# Altium project audio_dev_pcb.PrjPcb (part 1 of 3)
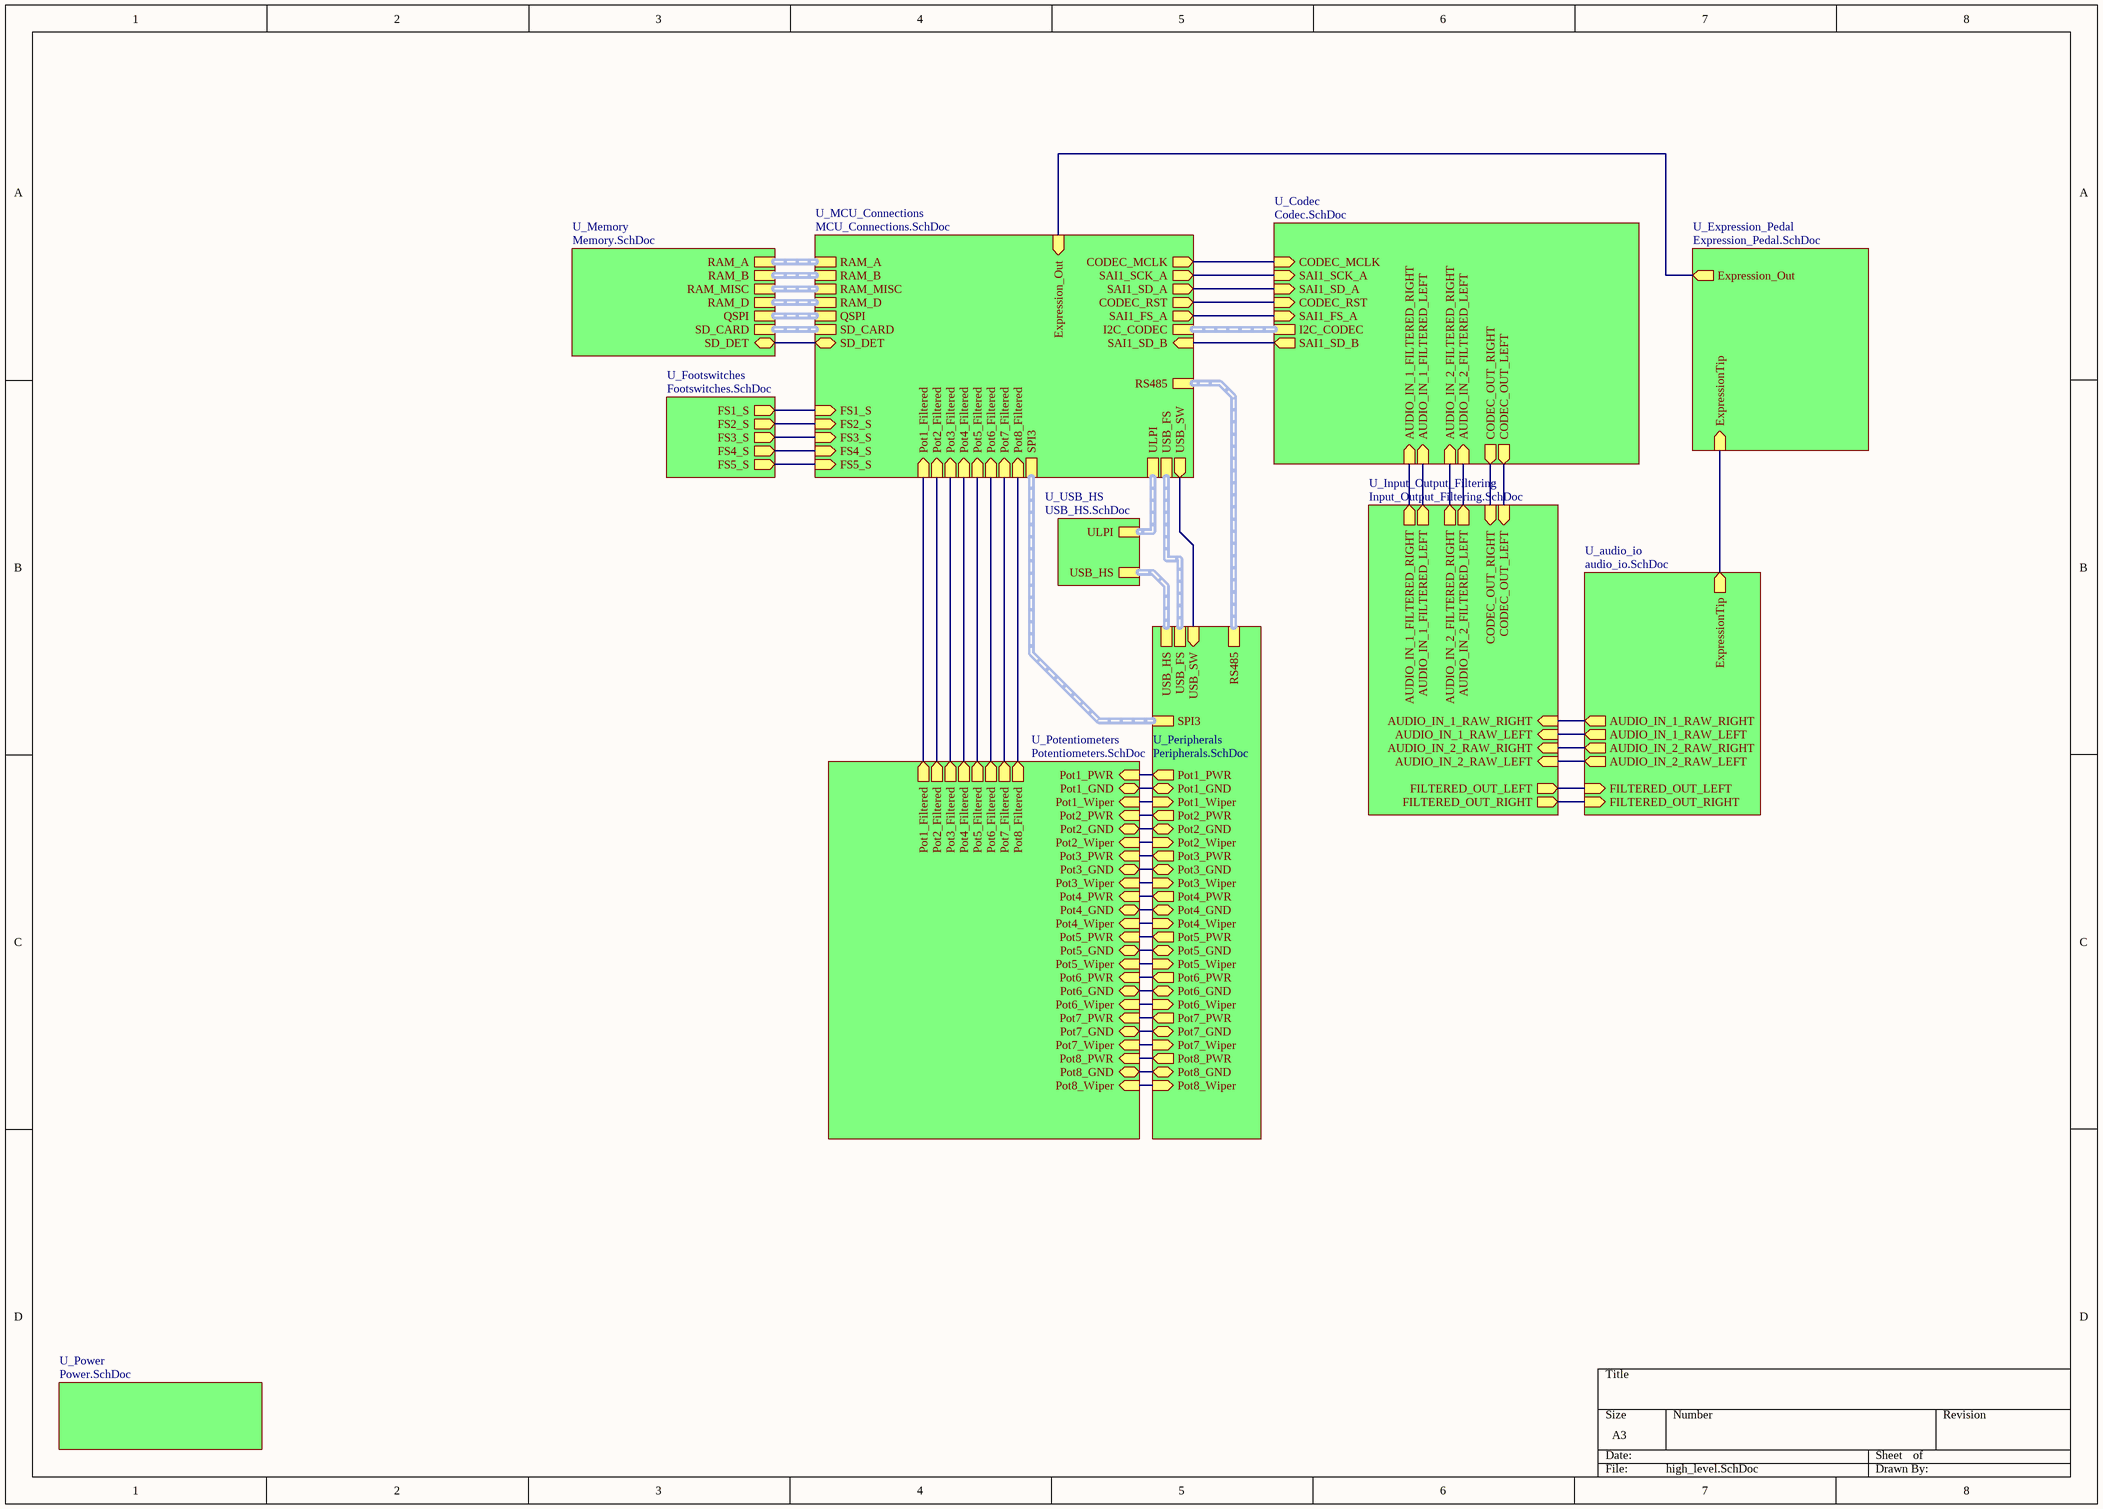
[diagram p0: high_level.SchDoc]
13 sheets, 355 parts. Net scope: hierarchical (ports join the sheet entries above them; power ports are global).
Board file: PCB1.PcbDoc
Sheets:
  high_level.SchDoc
    U_Codec = Codec.SchDoc
    U_Expression_Pedal = Expression_Pedal.SchDoc
    U_Input_Output_Filtering = Input_Output_Filtering.SchDoc
    U_Memory = Memory.SchDoc
    U_Power = Power.SchDoc
    U_USB_HS = USB_HS.SchDoc
    U_Peripherals = Peripherals.SchDoc
    U_Potentiometers = Potentiometers.SchDoc
    U_MCU_Connections = MCU_Connections.SchDoc
      U_MCU = MCU.SchDoc
    U_audio_io = audio_io.SchDoc
    U_Footswitches = Footswitches.SchDoc

## Sheet high_level.SchDoc
size A3; SheetNumber: 1; SheetTotal: 13

### Sub-sheets
U_audio_io = audio_io.SchDoc: ExpressionTip (out), AUDIO_IN_1_RAW_RIGHT (out), AUDIO_IN_1_RAW_LEFT (out), AUDIO_IN_2_RAW_LEFT (out), FILTERED_OUT_LEFT (in), FILTERED_OUT_RIGHT (in), AUDIO_IN_2_RAW_RIGHT (out)
U_Codec = Codec.SchDoc: CODEC_MCLK (in), SAI1_SCK_A (in), SAI1_SD_B (out), SAI1_SD_A (in), CODEC_RST (in), AUDIO_IN_2_FILTERED_LEFT (in), AUDIO_IN_2_FILTERED_RIGHT (in), CODEC_OUT_RIGHT (out), CODEC_OUT_LEFT (out), AUDIO_IN_1_FILTERED_LEFT (in), AUDIO_IN_1_FILTERED_RIGHT (in), I2C_CODEC (harness I2C), SAI1_FS_A (in)
U_Expression_Pedal = Expression_Pedal.SchDoc: ExpressionTip (in), Expression_Out (out)
U_Footswitches = Footswitches.SchDoc: FS1_S (out), FS2_S (out), FS3_S (out), FS4_S (out), FS5_S (out)
U_Input_Output_Filtering = Input_Output_Filtering.SchDoc: AUDIO_IN_1_RAW_LEFT (in), AUDIO_IN_1_FILTERED_LEFT (out), AUDIO_IN_1_RAW_RIGHT (in), AUDIO_IN_1_FILTERED_RIGHT (out), CODEC_OUT_LEFT (in), FILTERED_OUT_LEFT (out), CODEC_OUT_RIGHT (in), FILTERED_OUT_RIGHT (out), AUDIO_IN_2_RAW_LEFT (in), AUDIO_IN_2_FILTERED_LEFT (out), AUDIO_IN_2_RAW_RIGHT (in), AUDIO_IN_2_FILTERED_RIGHT (out)
U_MCU_Connections = MCU_Connections.SchDoc: ULPI (harness ULPI), RAM_A (harness RAM_A), RAM_B (harness RAM_B), RAM_MISC (harness RAM_MISC), RAM_D (harness RAM_D), QSPI (harness QSPI), SD_CARD (harness SD_CARD), USB_FS (harness USB_FS), USB_SW (out), I2C_CODEC (harness I2C), CODEC_MCLK (out), SAI1_SCK_A (out), SAI1_SD_B (in), SAI1_SD_A (out), CODEC_RST (out), Expression_Out (in), SAI1_FS_A (out), SD_DET (bidir), SPI3 (harness SPI3), Pot1_Filtered (in), Pot2_Filtered (in), Pot3_Filtered (in), Pot4_Filtered (in), Pot5_Filtered (in), Pot6_Filtered (in), Pot7_Filtered (in), Pot8_Filtered (in), RS485 (harness RS485), FS1_S (in), FS2_S (in), FS3_S (in), FS4_S (in), FS5_S (in)
U_Memory = Memory.SchDoc: RAM_D (harness RAM_D), RAM_A (harness RAM_A), RAM_B (harness RAM_B), RAM_MISC (harness RAM_MISC), SD_CARD (harness SD_CARD), SD_DET (bidir), QSPI (harness QSPI)
U_Peripherals = Peripherals.SchDoc: USB_SW (in), USB_HS (harness USB_HS), USB_FS (harness USB_FS), SPI3 (harness SPI3), Pot5_PWR (out), Pot5_Wiper (in), Pot5_GND (bidir), Pot4_PWR (out), Pot4_Wiper (in), Pot4_GND (bidir), Pot8_PWR (out), Pot8_Wiper (in), Pot8_GND (bidir), Pot6_PWR (out), Pot6_Wiper (in), Pot6_GND (bidir), Pot2_PWR (out), Pot2_Wiper (in), Pot2_GND (bidir), Pot1_Wiper (in), Pot1_GND (bidir), Pot7_PWR (out), Pot7_Wiper (in), Pot7_GND (bidir), Pot3_PWR (out), Pot3_Wiper (in), Pot3_GND (bidir), Pot1_PWR (out), RS485 (harness RS485)
U_Potentiometers = Potentiometers.SchDoc: Pot1_PWR (in), Pot1_Wiper (in), Pot1_GND (bidir), Pot2_PWR (in), Pot2_Wiper (in), Pot2_GND (bidir), Pot3_PWR (in), Pot3_Wiper (in), Pot3_GND (bidir), Pot4_PWR (in), Pot4_Wiper (in), Pot4_GND (bidir), Pot5_PWR (in), Pot5_Wiper (in), Pot5_GND (bidir), Pot6_PWR (in), Pot6_Wiper (in), Pot6_GND (bidir), Pot7_PWR (in), Pot7_Wiper (in), Pot7_GND (bidir), Pot8_PWR (in), Pot8_Wiper (in), Pot8_GND (bidir), Pot1_Filtered (out), Pot2_Filtered (out), Pot3_Filtered (out), Pot7_Filtered (out), Pot4_Filtered (out), Pot5_Filtered (out), Pot6_Filtered (out), Pot8_Filtered (out)
U_Power = Power.SchDoc: no entries
U_USB_HS = USB_HS.SchDoc: USB_HS (harness USB), ULPI (harness ULPI)

### Nets
+3V3: sheet U_Peripherals/Pot5_PWR, sheet U_Peripherals/Pot4_PWR, sheet U_Peripherals/Pot8_PWR, sheet U_Peripherals/Pot6_PWR, sheet U_Peripherals/Pot2_PWR, sheet U_Peripherals/Pot7_PWR, sheet U_Peripherals/Pot3_PWR, sheet U_Peripherals/Pot1_PWR, sheet U_Potentiometers/Pot1_PWR, sheet U_Potentiometers/Pot2_PWR, sheet U_Potentiometers/Pot3_PWR, sheet U_Potentiometers/Pot4_PWR, sheet U_Potentiometers/Pot5_PWR, sheet U_Potentiometers/Pot6_PWR, sheet U_Potentiometers/Pot7_PWR, sheet U_Potentiometers/Pot8_PWR
GND: sheet U_Peripherals/Pot5_GND, sheet U_Peripherals/Pot4_GND, sheet U_Peripherals/Pot8_GND, sheet U_Peripherals/Pot6_GND, sheet U_Peripherals/Pot2_GND, sheet U_Peripherals/Pot1_GND, sheet U_Peripherals/Pot7_GND, sheet U_Peripherals/Pot3_GND, sheet U_Potentiometers/Pot1_GND, sheet U_Potentiometers/Pot2_GND, sheet U_Potentiometers/Pot3_GND, sheet U_Potentiometers/Pot4_GND, sheet U_Potentiometers/Pot5_GND, sheet U_Potentiometers/Pot6_GND, sheet U_Potentiometers/Pot7_GND, sheet U_Potentiometers/Pot8_GND
AUDIO_IN_1_FILTERED_LEFT: sheet U_Codec/AUDIO_IN_1_FILTERED_LEFT, sheet U_Input_Output_Filtering/AUDIO_IN_1_FILTERED_LEFT
AUDIO_IN_1_FILTERED_RIGHT: sheet U_Codec/AUDIO_IN_1_FILTERED_RIGHT, sheet U_Input_Output_Filtering/AUDIO_IN_1_FILTERED_RIGHT
AUDIO_IN_1_RAW_LEFT: sheet U_Input_Output_Filtering/AUDIO_IN_1_RAW_LEFT, sheet U_audio_io/AUDIO_IN_1_RAW_LEFT
AUDIO_IN_1_RAW_RIGHT: sheet U_Input_Output_Filtering/AUDIO_IN_1_RAW_RIGHT, sheet U_audio_io/AUDIO_IN_1_RAW_RIGHT
AUDIO_IN_2_FILTERED_LEFT: sheet U_Codec/AUDIO_IN_2_FILTERED_LEFT, sheet U_Input_Output_Filtering/AUDIO_IN_2_FILTERED_LEFT
AUDIO_IN_2_FILTERED_RIGHT: sheet U_Codec/AUDIO_IN_2_FILTERED_RIGHT, sheet U_Input_Output_Filtering/AUDIO_IN_2_FILTERED_RIGHT
AUDIO_IN_2_RAW_LEFT: sheet U_Input_Output_Filtering/AUDIO_IN_2_RAW_LEFT, sheet U_audio_io/AUDIO_IN_2_RAW_LEFT
AUDIO_IN_2_RAW_RIGHT: sheet U_Input_Output_Filtering/AUDIO_IN_2_RAW_RIGHT, sheet U_audio_io/AUDIO_IN_2_RAW_RIGHT
CODEC_MCLK: sheet U_Codec/CODEC_MCLK, sheet U_MCU_Connections/CODEC_MCLK
CODEC_OUT_LEFT: sheet U_Codec/CODEC_OUT_LEFT, sheet U_Input_Output_Filtering/CODEC_OUT_LEFT
CODEC_OUT_RIGHT: sheet U_Codec/CODEC_OUT_RIGHT, sheet U_Input_Output_Filtering/CODEC_OUT_RIGHT
CODEC_RST: sheet U_Codec/CODEC_RST, sheet U_MCU_Connections/CODEC_RST
Expression_Out: sheet U_Expression_Pedal/Expression_Out, sheet U_MCU_Connections/Expression_Out
ExpressionTip: sheet U_Expression_Pedal/ExpressionTip, sheet U_audio_io/ExpressionTip
FILTERED_OUT_LEFT: sheet U_Input_Output_Filtering/FILTERED_OUT_LEFT, sheet U_audio_io/FILTERED_OUT_LEFT
FILTERED_OUT_RIGHT: sheet U_Input_Output_Filtering/FILTERED_OUT_RIGHT, sheet U_audio_io/FILTERED_OUT_RIGHT
FS_SIG1: sheet U_MCU_Connections/FS1_S, sheet U_Footswitches/FS1_S
FS_SIG2: sheet U_MCU_Connections/FS2_S, sheet U_Footswitches/FS2_S
FS_SIG3: sheet U_MCU_Connections/FS3_S, sheet U_Footswitches/FS3_S
FS_SIG4: sheet U_MCU_Connections/FS4_S, sheet U_Footswitches/FS4_S
FS_SIG5: sheet U_MCU_Connections/FS5_S, sheet U_Footswitches/FS5_S
Pot1_Filtered: sheet U_Potentiometers/Pot1_Filtered, sheet U_MCU_Connections/Pot1_Filtered
Pot1_Wiper: sheet U_Peripherals/Pot1_Wiper, sheet U_Potentiometers/Pot1_Wiper
Pot2_Filtered: sheet U_Potentiometers/Pot2_Filtered, sheet U_MCU_Connections/Pot2_Filtered
Pot2_Wiper: sheet U_Peripherals/Pot2_Wiper, sheet U_Potentiometers/Pot2_Wiper
Pot3_Filtered: sheet U_Potentiometers/Pot3_Filtered, sheet U_MCU_Connections/Pot3_Filtered
Pot3_Wiper: sheet U_Peripherals/Pot3_Wiper, sheet U_Potentiometers/Pot3_Wiper
Pot4_Filtered: sheet U_Potentiometers/Pot4_Filtered, sheet U_MCU_Connections/Pot4_Filtered
Pot4_Wiper: sheet U_Peripherals/Pot4_Wiper, sheet U_Potentiometers/Pot4_Wiper
Pot5_Filtered: sheet U_Potentiometers/Pot5_Filtered, sheet U_MCU_Connections/Pot5_Filtered
Pot5_Wiper: sheet U_Peripherals/Pot5_Wiper, sheet U_Potentiometers/Pot5_Wiper
Pot6_Filtered: sheet U_Potentiometers/Pot6_Filtered, sheet U_MCU_Connections/Pot6_Filtered
Pot6_Wiper: sheet U_Peripherals/Pot6_Wiper, sheet U_Potentiometers/Pot6_Wiper
Pot7_Filtered: sheet U_Potentiometers/Pot7_Filtered, sheet U_MCU_Connections/Pot7_Filtered
Pot7_Wiper: sheet U_Peripherals/Pot7_Wiper, sheet U_Potentiometers/Pot7_Wiper
Pot8_Filtered: sheet U_Potentiometers/Pot8_Filtered, sheet U_MCU_Connections/Pot8_Filtered
Pot8_Wiper: sheet U_Peripherals/Pot8_Wiper, sheet U_Potentiometers/Pot8_Wiper
SAI1_FS_A: sheet U_Codec/SAI1_FS_A, sheet U_MCU_Connections/SAI1_FS_A
SAI1_SCK_A: sheet U_Codec/SAI1_SCK_A, sheet U_MCU_Connections/SAI1_SCK_A
SAI1_SD_A: sheet U_Codec/SAI1_SD_A, sheet U_MCU_Connections/SAI1_SD_A
SAI1_SD_B: sheet U_Codec/SAI1_SD_B, sheet U_MCU_Connections/SAI1_SD_B
SD_DET: sheet U_Memory/SD_DET, sheet U_MCU_Connections/SD_DET
USB_SW: sheet U_Peripherals/USB_SW, sheet U_MCU_Connections/USB_SW

### Buses and harness runs
harness sheet U_Codec/I2C_CODEC = sheet U_MCU_Connections/I2C_CODEC
harness sheet U_MCU_Connections/QSPI = sheet U_Memory/QSPI
harness sheet U_MCU_Connections/RAM_A = sheet U_Memory/RAM_A
harness sheet U_MCU_Connections/RAM_B = sheet U_Memory/RAM_B
harness sheet U_MCU_Connections/RAM_D = sheet U_Memory/RAM_D
harness sheet U_MCU_Connections/RAM_MISC = sheet U_Memory/RAM_MISC
harness sheet U_MCU_Connections/RS485 = sheet U_Peripherals/RS485
harness sheet U_MCU_Connections/SD_CARD = sheet U_Memory/SD_CARD
harness sheet U_MCU_Connections/SPI3 = sheet U_Peripherals/SPI3
harness sheet U_MCU_Connections/ULPI = sheet U_USB_HS/ULPI
harness sheet U_MCU_Connections/USB_FS = sheet U_Peripherals/USB_FS
harness sheet U_Peripherals/USB_HS = sheet U_USB_HS/USB_HS

## Sheet Codec.SchDoc
size A3; SheetNumber: 8; SheetTotal: 13
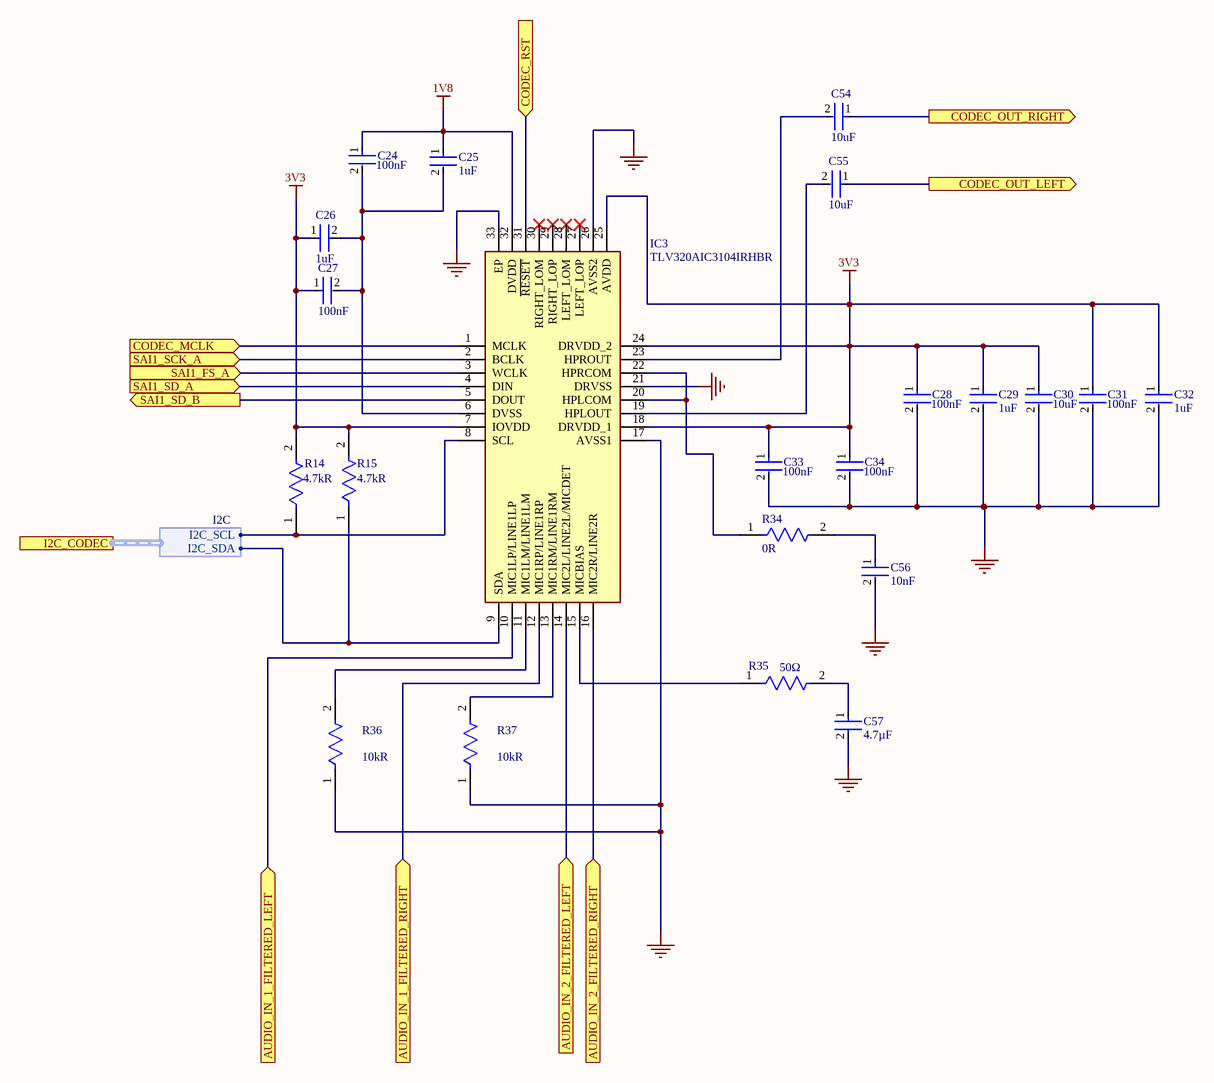
[diagram p1: Codec.SchDoc]

### Parts
C24  Capacitance: 100nF  [FP-GRM033-0_03-IPC_C]  (hidden comment: GRM033C71C104ME14J)
C25  Capacitance: 1uF  [FP-GRM155-0_1-IPC_B]  (hidden comment: GRM155C70J105ME11J)
C26  Capacitance: 1uF  [FP-GRM155-0_1-IPC_B]  (hidden comment: GRM155C70J105ME11J)
C27  Capacitance: 100nF  [FP-GRM033-0_03-IPC_C]  (hidden comment: GRM033C71C104ME14J)
C28  Capacitance: 100nF  [FP-GRM033-0_03-IPC_C]  (hidden comment: GRM033C71C104ME14J)
C29  Capacitance: 1uF  [FP-GRM155-0_1-IPC_B]  (hidden comment: GRM155C70J105ME11J)
C30  Capacitance: 10uF  [FP-GRM21B-0_15-IPC_C]  (hidden comment: GRM21BC81E106KE51K)
C31  Capacitance: 100nF  [FP-GRM033-0_03-IPC_C]  (hidden comment: GRM033C71C104ME14J)
C32  Capacitance: 1uF  [FP-GRM155-0_1-IPC_B]  (hidden comment: GRM155C70J105ME11J)
C33  Capacitance: 100nF  [FP-GRM033-0_03-IPC_C]  (hidden comment: GRM033C71C104ME14J)
C34  Capacitance: 100nF  [FP-GRM033-0_03-IPC_C]  (hidden comment: GRM033C71C104ME14J)
C54  Capacitance: 10uF  [FP-GRM21B-0_15-IPC_C]  (hidden comment: GRM21BC81E106KE51K)
C55  Capacitance: 10uF  [FP-GRM21B-0_15-IPC_C]  (hidden comment: GRM21BC81E106KE51K)
C56  Capacitance: 10nF  [FP-GCM155-0_05-MFG]  (hidden comment: GCM155R71H103KA55W)
C57  Capacitance: 4.7µF  [FP-GCM155-0_2-MFG]  (hidden comment: GCM155D70G475ME36D)
IC3  TLV320AIC3104IRHBR  [TLV320AIC3104IRHBR]
R14  Resistance: 4.7kR  [FP-RC1005-IPC_C]  (hidden comment: RC1005J472CS)
R15  Resistance: 4.7kR  [FP-RC1005-IPC_C]  (hidden comment: RC1005J472CS)
R34  Resistance: 0R  [FP-RMCF0402-MFG]  (hidden comment: RMCF0402ZT0R00)
R35  Resistance: 50Ω  [FP-RC0402-0_4-MFG]  (hidden comment: RC0402JR-0750RL)
R36  Resistance: 10kR  [FP-RC0402-0_4-IPC_A]  (hidden comment: RC0402FR-1310KL)
R37  Resistance: 10kR  [FP-RC0402-0_4-IPC_A]  (hidden comment: RC0402FR-1310KL)

### Ports
AUDIO_IN_1_FILTERED_LEFT (in, see high_level[6B], Input_Output_Filtering[6B]), AUDIO_IN_1_FILTERED_RIGHT (in, see high_level[6B], Input_Output_Filtering[6C]), AUDIO_IN_2_FILTERED_LEFT (in, see high_level[6B], Input_Output_Filtering[6A]), AUDIO_IN_2_FILTERED_RIGHT (in, see high_level[6B], Input_Output_Filtering[6B]), CODEC_MCLK (in, see high_level[5A], MCU_Connections[5B]), CODEC_OUT_LEFT (out, see high_level[6B], Input_Output_Filtering[3C]), CODEC_OUT_RIGHT (out, see high_level[6B], Input_Output_Filtering[3D]), CODEC_RST (in, see high_level[5A], MCU_Connections[5B]), I2C_CODEC (harness I2C, see high_level[5A], MCU_Connections[5B]), SAI1_FS_A (in, see high_level[5A], MCU_Connections[5B]), SAI1_SCK_A (in, see high_level[5A], MCU_Connections[5B]), SAI1_SD_A (in, see high_level[5A], MCU_Connections[5B]), SAI1_SD_B (out, see high_level[5A], MCU_Connections[5B])

### Harnesses
I2C: I2C_SCL, I2C_SDA

### Nets
1V8: C24.1 C25.1 IC3.32(DVDD)
3V3: C26.1 C27.1 C28.1 C29.1 C30.1 C31.1 C32.1 C33.1 C34.1 IC3.7(IOVDD) IC3.18(DRVDD_1) IC3.24(DRVDD_2) IC3.25(AVDD) R14.2 R15.2
GND: C28.2 C29.2 C30.2 C31.2 C32.2 C33.2 C34.2 C56.2 C57.2 IC3.17(AVSS1) IC3.21(DRVSS) IC3.26(AVSS2) IC3.33(EP) R36.1 R37.1
AUDIO_IN_1_FILTERED_LEFT: IC3.10(MIC1LP/LINE1LP) ; port AUDIO_IN_1_FILTERED_LEFT
AUDIO_IN_1_FILTERED_RIGHT: IC3.12(MIC1RP/LINE1RP) ; port AUDIO_IN_1_FILTERED_RIGHT
AUDIO_IN_2_FILTERED_LEFT: IC3.14(MIC2L/LINE2L/MICDET) ; port AUDIO_IN_2_FILTERED_LEFT
AUDIO_IN_2_FILTERED_RIGHT: IC3.16(MIC2R/LINE2R) ; port AUDIO_IN_2_FILTERED_RIGHT
CODEC_MCLK: IC3.1(MCLK) ; port CODEC_MCLK
CODEC_OUT_LEFT: C55.1 ; port CODEC_OUT_LEFT
CODEC_OUT_RIGHT: C54.1 ; port CODEC_OUT_RIGHT
CODEC_RST: IC3.31(~{RESET}) ; port CODEC_RST
SAI1_FS_A: IC3.3(WCLK) ; port SAI1_FS_A
SAI1_SCK_A: IC3.2(BCLK) ; port SAI1_SCK_A
SAI1_SD_A: IC3.4(DIN) ; port SAI1_SD_A
SAI1_SD_B: IC3.5(DOUT) ; port SAI1_SD_B
NetC24_2: C24.2 C25.2 C26.2 C27.2 IC3.6(DVSS)
NetC54_2: C54.2 IC3.23(HPROUT)
NetC55_2: C55.2 IC3.19(HPLOUT)
NetC56_1: C56.1 R34.2
NetC57_1: C57.1 R35.2
NetIC3_8: IC3.8(SCL) R14.1 ; port I2C_CODEC.I2C_SCL
NetIC3_9: IC3.9(SDA) R15.1 ; port I2C_CODEC.I2C_SDA
NetIC3_11: IC3.11(MIC1LM/LINE1LM) R36.2
NetIC3_13: IC3.13(MIC1RM/LINE1RM) R37.2
NetIC3_15: IC3.15(MICBIAS) R35.1
NetIC3_20: IC3.20(HPLCOM) IC3.22(HPRCOM) R34.1

Not connected (* = marked no-connect by the designer): IC3 27(LEFT_LOP)* 28(LEFT_LOM)* 29(RIGHT_LOP)* 30(RIGHT_LOM)*

### Library data of the parts
C24 C27 C28 C31 C33 C34 = CMP-06035-001619-1: Chip Multilayer Ceramic Capacitors for General Purpose, 0201, 0.10uF, X7S, 22%, 20%, 16V; Dielectric: X7S; Tolerance: 20%; Length: 600um; Width: 300um; Voltage Rating (DC): 16V; Thickness: 300um
C25 C26 C29 C32 = CMP-06035-036014-1: Chip Multilayer Ceramic Capacitors for General Purpose, 0402, 1.0uF, X7S, 22%, 20%, 6.3V; Tolerance: 20%; Dielectric: X7S; Length: 1mm; Voltage Rating (DC): 6.3V; Thickness: 500um; Width: 500um
C30 C54 C55 = CMP-06035-031044-1: Chip Multilayer Ceramic Capacitors for General Purpose, 0805, 10uF, X6S, 22%, 10%, 25V; Case/Package: 0805; Length: 2mm; Dielectric: X6S; Voltage Rating (DC): 25V; Thickness: 1.25mm; Width: 1.25mm; Tolerance: 10%
C56 = CMP-06035-055122-1: Ceramic Capacitor for Automotive 10nF ±10% 50VDC X7R 0402 Paper T/R
C57 = CMP-00260-135863758-1: GCM155D70G475ME36D AC 2C 216S Skt Recp; Tolerance: 20%; Voltage Rating: 4V; Material: Ceramic; Lifecycle Status: Production; Height: 700µm; Min Operating Temperature: -55°C; NexarPartId: 135863758; Max Operating Temperature: 125°C; Case/Package: 0402
IC3 = TLV320AIC3104IRHBR: Integrated Circuit; Manufacturer_Name: Texas Instruments; Datasheet Link: http://www.ti.com/lit/ds/symlink/tlv320aic3104.pdf; Height: 1mm; Manufacturer_Part_Number: TLV320AIC3104IRHBR; Mouser Part Number: 595-TLV320C3104IRHBR; Mouser Price/Stock: https://www.mouser.co.uk/ProductDetail/Texas-Instruments/TLV320AIC3104IRHBR?qs=t6sYTo5dwUzbYVbTYmm%2FAg%3D%3D; Arrow Part Number: TLV320AIC3104IRHBR; Arrow Price/Stock: https://www.arrow.com/en/products/tlv320aic3104irhbr/texas-instruments?utm_currency=USD&region=nac
R14 R15 = CMP-13261-005440-1: Res Thick Film 0402 4.7kΩ 5% 0.063W ±100ppm/°C Molded SMD T/R; Power Rating: 63mW; Voltage Rating (DC): 50V; Depth: 0.5mm; Length: 1mm; Package Quantity: 1; Composition: Thick Film; Temperature Coefficient: 100ppm/°C; Case Code (Metric): 1005; Mount: Surface Mount; Lead Free: Lead Free; Features: Moisture Resistant; Max Power Dissipation: 63mW; Tolerance: 5%; Height: 0.016inch; Case Code (Imperial): 0402; Packaging: Tape and Reel; Min Operating Temperature: -55°C; Radiation Hardening: No; Contact Plating: Tin; Case/Package: 0402; Width: 0.02inch; Military Standard: Not; Max Operating Temperature: 125°C; Number of Terminations: 2
R34 = CMP-26527-007617-1: RES 0 OHM JUMPER 1/16W 0402; Power Rating: 63mW; Working Voltage: 50V; Current Rating: 1A; Series: RMCF; RoHS Compliant: Yes; Features: Automotive AEC-Q200; Width: 0.02inch; Depth: 0.5mm; Resistor Type: Thick Film; Number of Terminations: 2; Radiation Hardening: No; Length: 0.039inch; Contact Plating: Tin; Case/Package: 0402; Min Operating Temperature: -55°C; Case Code (Metric): 1005; Construction: Rectangular; Mount: Surface Mount; Max Operating Temperature: 155°C; Max Power Dissipation: 63mW; Height: 0.016inch; Lead Free: Lead Free; Packaging: Tape and Reel; Technology: THICK FILM; Case Code (Imperial): 0402; Military Standard: Not
R35 = CMP-00621-24490980-1: RC0402JR-0750RL SMD Chip Resistor, 50 Ohm, ± 5%, 63 mW, 0402 [1005 Metric], Thick Film, General Purpose; Temperature Coefficient: 100ppm/°C; Max Power Dissipation: 63mW; Width: 508µm; RoHS: Compliant; Height: 406.4µm; Length: 990.6µm; Features: Moisture Resistant; Tolerance: 5%; Lead Free: Lead Free; Case/Package: 0402; NexarPartId: 24490980; Min Operating Temperature: -55°C; Composition: Thick Film; Packaging: Tape & Reel (TR); Schedule B: 8533210045, 8533210045; Number of Terminations: 2; Max Operating Temperature: 155°C
R36 R37 = CMP-2002-07854-2: RESISTOR 0402 10K 1%; Power Rating: 62.5mW; Voltage Rating (DC): 50V; Temperature Coefficient: 100ppm/°C; REACH SVHC: No SVHC; Case/Package: 0402; Termination: SMD/SMT; Max Operating Temperature: 155°C; Contact Plating: Tin; Resistance Tolerance: 1%; Radiation Hardening: No; Voltage Rating: 50V; Lead Free: Lead Free; Length: 1mm; Depth: 0.5mm; Number of Pins: 2; RoHS Compliant: Yes; Case Code (Imperial): 0402; Case Code (Metric): 1005; Min Operating Temperature: -55°C; Packaging: Tape and Reel; Technology: THICK FILM; Series: RC; Number of Terminations: 2; Resistor Type: Thick Film; Tolerance: 1%; Working Voltage: 50V; Military Standard: Not; Construction: Rectangular

## Sheet Expression_Pedal.SchDoc
size A3; SheetNumber: 9; SheetTotal: 13
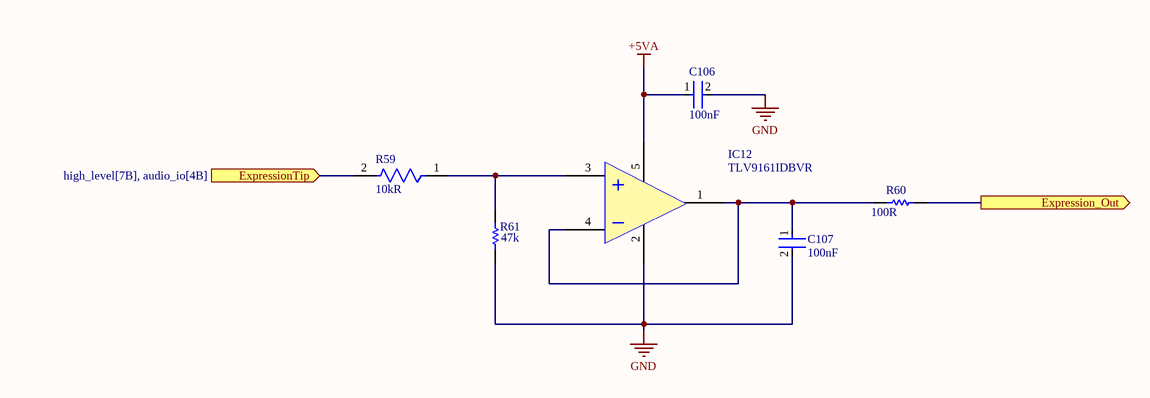
[diagram p2: Expression_Pedal.SchDoc]

### Parts
C106  Capacitance: 100nF  [FP-GRM033-0_03-IPC_C]  (hidden comment: GRM033C71C104ME14J)
C107  Capacitance: 100nF  [FP-GRM033-0_03-IPC_C]  (hidden comment: GRM033C71C104ME14J)
IC12  TLV9161IDBVR  [SOT95P280X145-5N]
R59  Resistance: 10kR  [FP-RC0402-0_4-IPC_A]  (hidden comment: RC0402FR-1310KL)
R60  Resistance: 100R  [RESC1005X40X25NL05T10]  (hidden comment: RC0402JR-07100RL)
R61  Resistance: 47k  [RESC1005X40X25LL05T10]  (hidden comment: RC0402JR-0747KL)

### Ports
Expression_Out (out, see high_level[7A], MCU_Connections[7B]), ExpressionTip (in, see high_level[7B], audio_io[4B])

### Nets
+5VA: C106.1 IC12.5(V+)
GND: C106.2 C107.2 IC12.2(V-) R61.1
Expression_Out: R60.2 ; port Expression_Out
ExpressionTip: R59.2 ; port ExpressionTip
NetC107_1: C107.1 IC12.1(OUT) IC12.4(IN-) R60.1
NetIC12_3: IC12.3(IN+) R59.1 R61.2

### Library data of the parts
C106 C107 = CMP-06035-001619-1: as C24 on sheet Codec; Dielectric: X7S; Tolerance: 20%; Length: 600um; Width: 300um; Voltage Rating (DC): 16V; Thickness: 300um
IC12 = TLV9161IDBVR: Integrated Circuit; Manufacturer_Name: Texas Instruments; Datasheet Link: https://www.ti.com/lit/ds/symlink/tlv9161.pdf?HQS=dis-mous-null-mousermode-dsf-pf-null-wwe&ts=1675947383550&ref_url=https%253A%252F%252Fwww.mouser.de%252F; Height: 1.45mm; Manufacturer_Part_Number: TLV9161IDBVR; Mouser Part Number: 595-TLV9161IDBVR; Mouser Price/Stock: https://www.mouser.co.uk/ProductDetail/Texas-Instruments/TLV9161IDBVR?qs=Rp5uXu7WBW%2FkWJAGvxG3xQ%3D%3D; Arrow Part Number: TLV9161IDBVR; Arrow Price/Stock: https://www.arrow.com/en/products/tlv9161idbvr/texas-instruments?utm_currency=USD&region=nac
R59 = CMP-2002-07854-2: as R36 on sheet Codec; REACH SVHC: No SVHC; Case/Package: 0402; Termination: SMD/SMT; Max Operating Temperature: 155°C; Contact Plating: Tin; Resistance Tolerance: 1%; Radiation Hardening: No; Voltage Rating: 50V; Lead Free: Lead Free; Length: 1mm; Depth: 0.5mm; Number of Pins: 2; RoHS Compliant: Yes; Case Code (Imperial): 0402; Case Code (Metric): 1005; Min Operating Temperature: -55°C; Packaging: Tape and Reel; Technology: THICK FILM; Series: RC; Number of Terminations: 2; Resistor Type: Thick Film; Tolerance: 1%; Working Voltage: 50V; Military Standard: Not; Construction: Rectangular
R60 = CMP-2002-07914-1: Manufacturer: Yageo / Phycomp; Part Number: RC0402JR-07100RL
R61 = CMP-1011-00114-2: Manufacturer: Yageo / Phycomp; Part Number: RC0402JR-0747KL

## Sheet Input_Output_Filtering.SchDoc
size A2; SheetNumber: 11; SheetTotal: 13
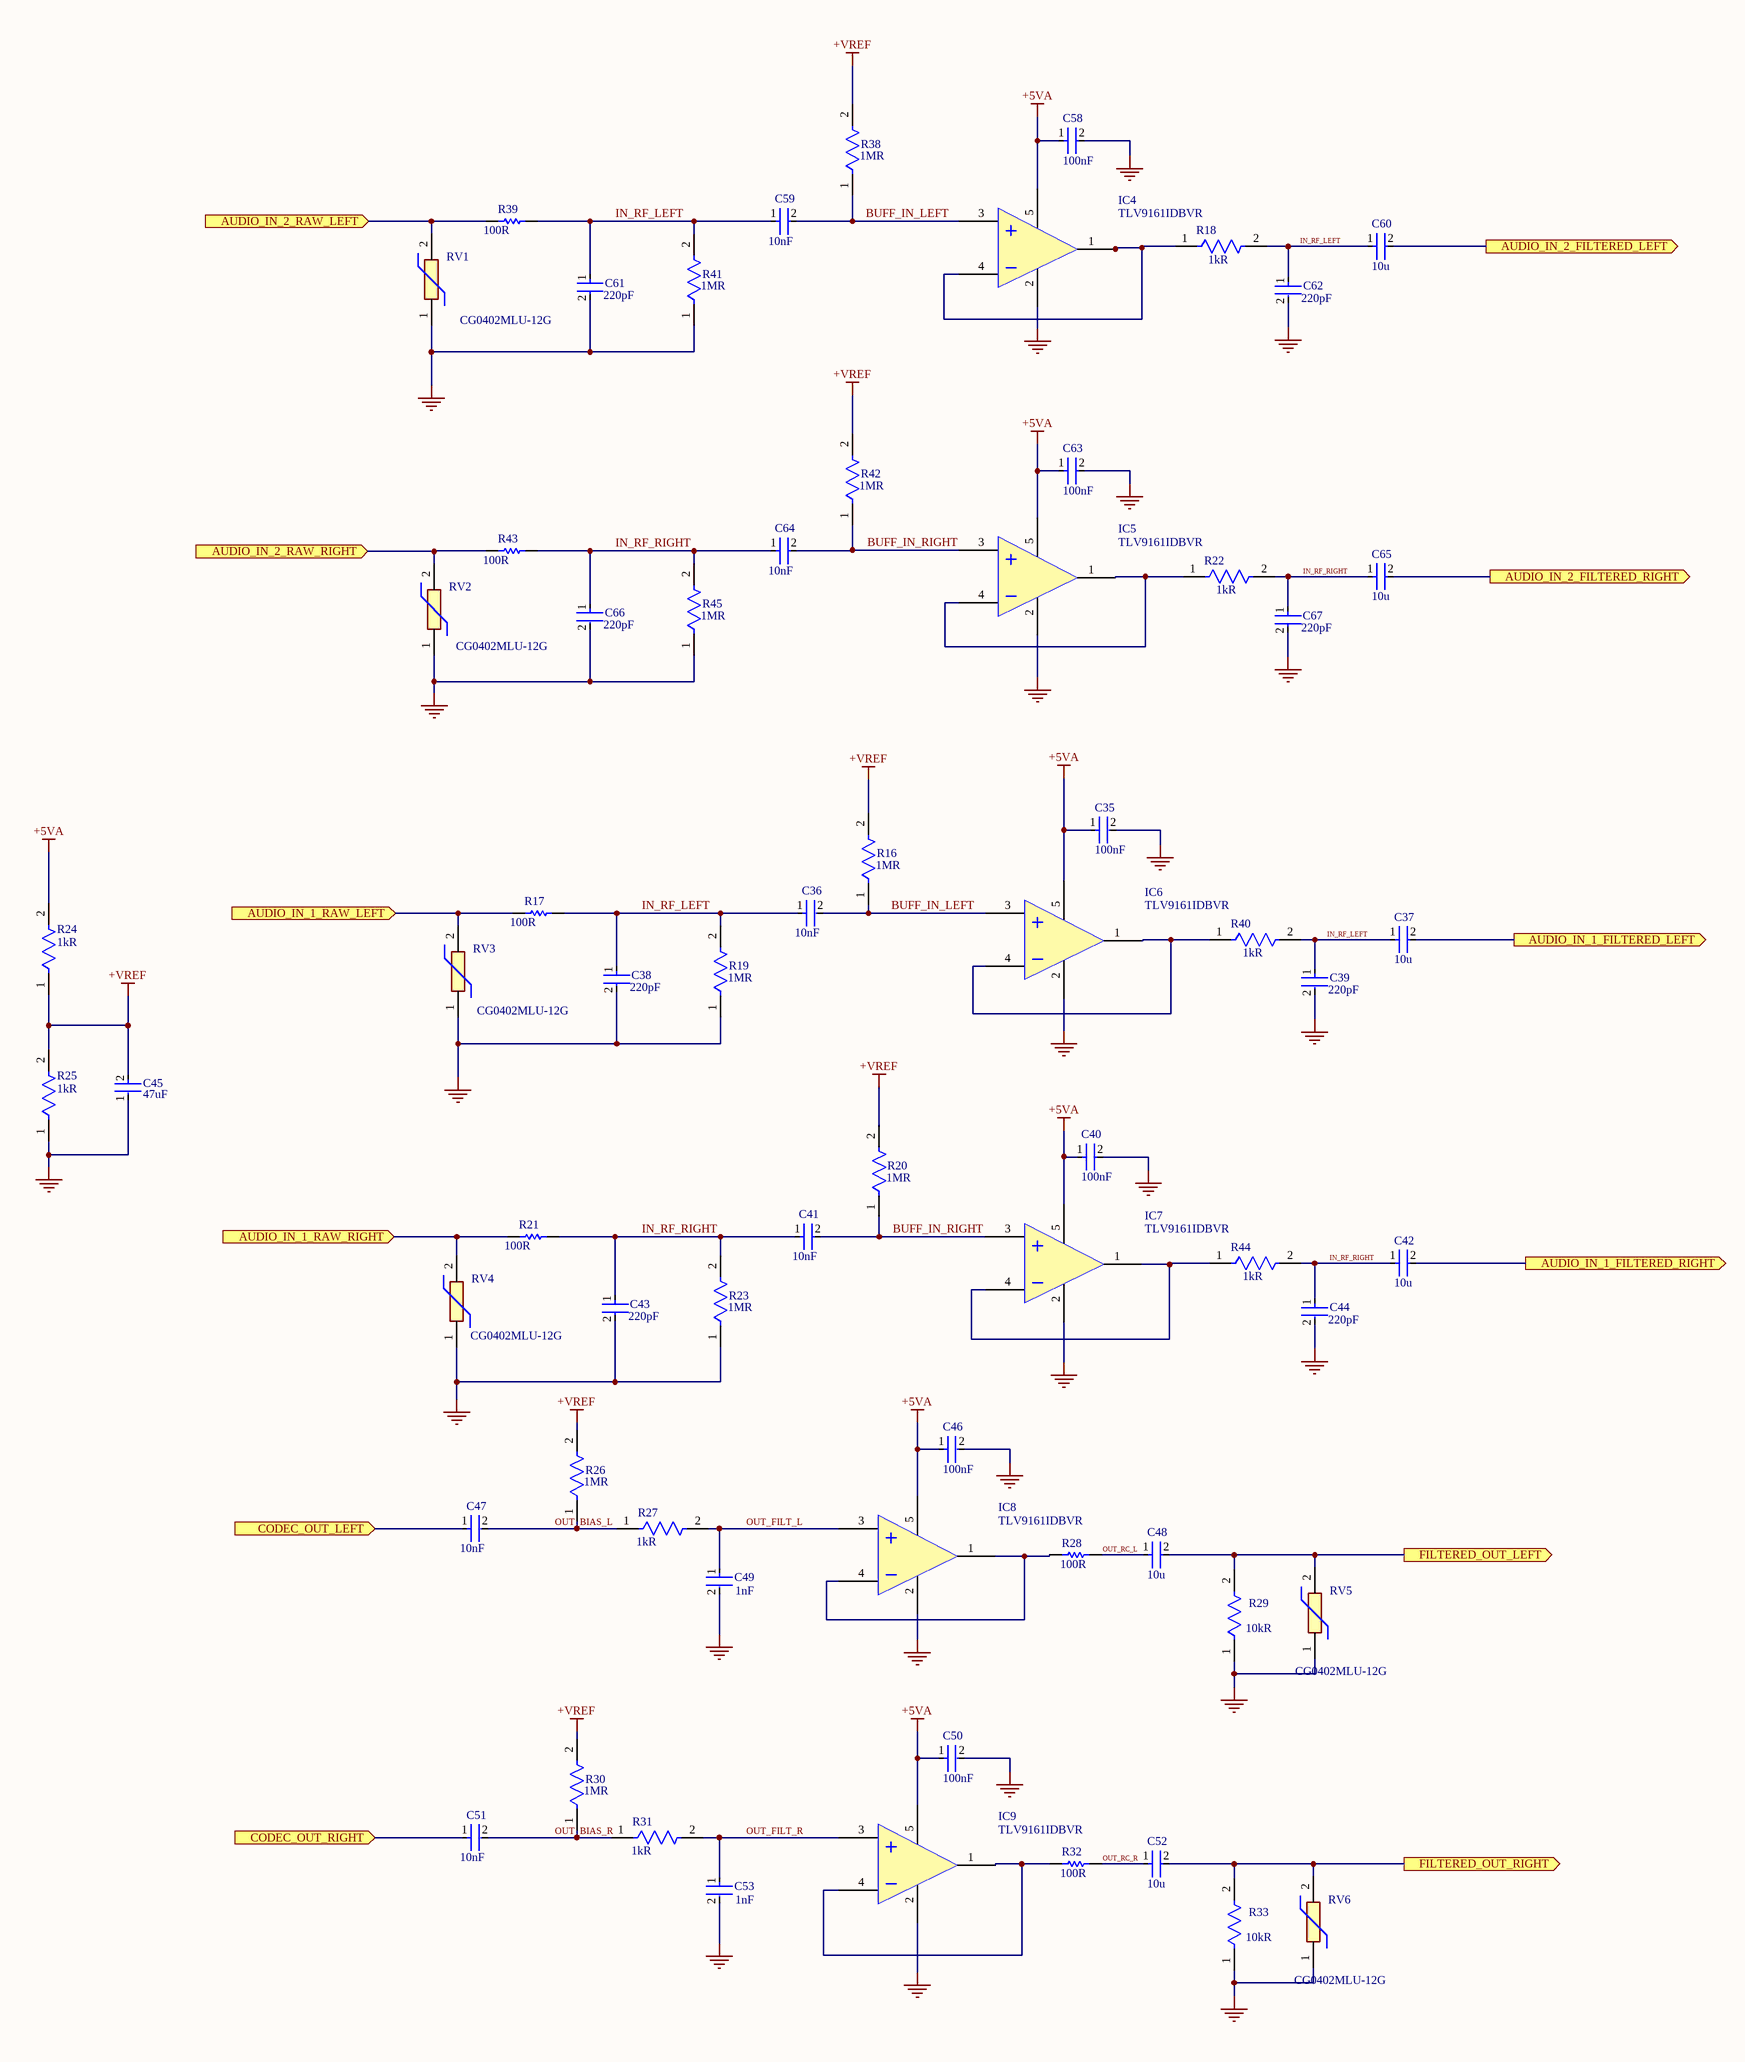
[diagram p3: Input_Output_Filtering.SchDoc]

### Parts
C35  Capacitance: 100nF  [FP-GRM033-0_03-IPC_C]  (hidden comment: GRM033C71C104ME14J)
C36  Capacitance: 10nF  [FP-GCM155-0_05-MFG]  (hidden comment: GCM155R71H103KA55W)
C37  Capacitor: 10u  [FP-GCM188-0_2-IPC_A]  (hidden comment: GCM188D70G106ME36J)
C38  Capacitance: 220pF  [FP-GCM155-0_05-IPC_B]  (hidden comment: GCM155R71H221KA37J)
C39  Capacitance: 220pF  [FP-GCM155-0_05-IPC_B]  (hidden comment: GCM155R71H221KA37J)
C40  Capacitance: 100nF  [FP-GRM033-0_03-IPC_C]  (hidden comment: GRM033C71C104ME14J)
C41  Capacitance: 10nF  [FP-GCM155-0_05-MFG]  (hidden comment: GCM155R71H103KA55W)
C42  Capacitor: 10u  [FP-GCM188-0_2-IPC_A]  (hidden comment: GCM188D70G106ME36J)
C43  Capacitance: 220pF  [FP-GCM155-0_05-IPC_B]  (hidden comment: GCM155R71H221KA37J)
C44  Capacitance: 220pF  [FP-GCM155-0_05-IPC_B]  (hidden comment: GCM155R71H221KA37J)
C45  Capacitance: 47uF  [FP-GCM32E-0_3-MFG]  (hidden comment: GCM32EC71A476KE02K)
C46  Capacitance: 100nF  [FP-GRM033-0_03-IPC_C]  (hidden comment: GRM033C71C104ME14J)
C47  Capacitance: 10nF  [FP-GCM155-0_05-MFG]  (hidden comment: GCM155R71H103KA55W)
C48  Capacitor: 10u  [FP-GCM188-0_2-IPC_A]  (hidden comment: GCM188D70G106ME36J)
C49  Capacitance: 1nF  [FP-GCM155-0_05-IPC_C]  (hidden comment: GCM155R71H102KA37W)
C50  Capacitance: 100nF  [FP-GRM033-0_03-IPC_C]  (hidden comment: GRM033C71C104ME14J)
C51  Capacitance: 10nF  [FP-GCM155-0_05-MFG]  (hidden comment: GCM155R71H103KA55W)
C52  Capacitor: 10u  [FP-GCM188-0_2-IPC_A]  (hidden comment: GCM188D70G106ME36J)
C53  Capacitance: 1nF  [FP-GCM155-0_05-IPC_C]  (hidden comment: GCM155R71H102KA37W)
C58  Capacitance: 100nF  [FP-GRM033-0_03-IPC_C]  (hidden comment: GRM033C71C104ME14J)
C59  Capacitance: 10nF  [FP-GCM155-0_05-MFG]  (hidden comment: GCM155R71H103KA55W)
C60  Capacitor: 10u  [FP-GCM188-0_2-IPC_A]  (hidden comment: GCM188D70G106ME36J)
C61  Capacitance: 220pF  [FP-GCM155-0_05-IPC_B]  (hidden comment: GCM155R71H221KA37J)
C62  Capacitance: 220pF  [FP-GCM155-0_05-IPC_B]  (hidden comment: GCM155R71H221KA37J)
C63  Capacitance: 100nF  [FP-GRM033-0_03-IPC_C]  (hidden comment: GRM033C71C104ME14J)
C64  Capacitance: 10nF  [FP-GCM155-0_05-MFG]  (hidden comment: GCM155R71H103KA55W)
C65  Capacitor: 10u  [FP-GCM188-0_2-IPC_A]  (hidden comment: GCM188D70G106ME36J)
C66  Capacitance: 220pF  [FP-GCM155-0_05-IPC_B]  (hidden comment: GCM155R71H221KA37J)
C67  Capacitance: 220pF  [FP-GCM155-0_05-IPC_B]  (hidden comment: GCM155R71H221KA37J)
IC4  TLV9161IDBVR  [SOT95P280X145-5N]
IC5  TLV9161IDBVR  [SOT95P280X145-5N]
IC6  TLV9161IDBVR  [SOT95P280X145-5N]
IC7  TLV9161IDBVR  [SOT95P280X145-5N]
IC8  TLV9161IDBVR  [SOT95P280X145-5N]
IC9  TLV9161IDBVR  [SOT95P280X145-5N]
R16  Resistance: 1MR  [FP-RC0402-0_4-IPC_A]  (hidden comment: RC0402JR-071ML)
R17  Resistance: 100R  [RESC1005X40X25NL05T10]  (hidden comment: RC0402JR-07100RL)
R18  Resistance: 1kR  [FP-AC0402-IPC_C]  (hidden comment: AC0402JR-071KL)
R19  Resistance: 1MR  [FP-RC0402-0_4-IPC_A]  (hidden comment: RC0402JR-071ML)
R20  Resistance: 1MR  [FP-RC0402-0_4-IPC_A]  (hidden comment: RC0402JR-071ML)
R21  Resistance: 100R  [RESC1005X40X25NL05T10]  (hidden comment: RC0402JR-07100RL)
R22  Resistance: 1kR  [FP-AC0402-IPC_C]  (hidden comment: AC0402JR-071KL)
R23  Resistance: 1MR  [FP-RC0402-0_4-IPC_A]  (hidden comment: RC0402JR-071ML)
R24  Resistance: 1kR  [FP-AC0402-IPC_C]  (hidden comment: AC0402JR-071KL)
R25  Resistance: 1kR  [FP-AC0402-IPC_C]  (hidden comment: AC0402JR-071KL)
R26  Resistance: 1MR  [FP-RC0402-0_4-IPC_A]  (hidden comment: RC0402JR-071ML)
R27  Resistance: 1kR  [FP-AC0402-IPC_C]  (hidden comment: AC0402JR-071KL)
R28  Resistance: 100R  [RESC1005X40X25NL05T10]  (hidden comment: RC0402JR-07100RL)
R29  Resistance: 10kR  [FP-RC0402-0_4-IPC_A]  (hidden comment: RC0402FR-1310KL)
R30  Resistance: 1MR  [FP-RC0402-0_4-IPC_A]  (hidden comment: RC0402JR-071ML)
R31  Resistance: 1kR  [FP-AC0402-IPC_C]  (hidden comment: AC0402JR-071KL)
R32  Resistance: 100R  [RESC1005X40X25NL05T10]  (hidden comment: RC0402JR-07100RL)
R33  Resistance: 10kR  [FP-RC0402-0_4-IPC_A]  (hidden comment: RC0402FR-1310KL)
R38  Resistance: 1MR  [FP-RC0402-0_4-IPC_A]  (hidden comment: RC0402JR-071ML)
R39  Resistance: 100R  [RESC1005X40X25NL05T10]  (hidden comment: RC0402JR-07100RL)
R40  Resistance: 1kR  [FP-AC0402-IPC_C]  (hidden comment: AC0402JR-071KL)
R41  Resistance: 1MR  [FP-RC0402-0_4-IPC_A]  (hidden comment: RC0402JR-071ML)
R42  Resistance: 1MR  [FP-RC0402-0_4-IPC_A]  (hidden comment: RC0402JR-071ML)
R43  Resistance: 100R  [RESC1005X40X25NL05T10]  (hidden comment: RC0402JR-07100RL)
R44  Resistance: 1kR  [FP-AC0402-IPC_C]  (hidden comment: AC0402JR-071KL)
R45  Resistance: 1MR  [FP-RC0402-0_4-IPC_A]  (hidden comment: RC0402JR-071ML)
RV1  CG0402MLU-12G  [VARC1005X41N]
RV2  CG0402MLU-12G  [VARC1005X41N]
RV3  CG0402MLU-12G  [VARC1005X41N]
RV4  CG0402MLU-12G  [VARC1005X41N]
RV5  CG0402MLU-12G  [VARC1005X41N]
RV6  CG0402MLU-12G  [VARC1005X41N]

### Ports
AUDIO_IN_1_FILTERED_LEFT (out, see high_level[6B], Codec[3D]), AUDIO_IN_1_FILTERED_RIGHT (out, see high_level[6B], Codec[4D]), AUDIO_IN_1_RAW_LEFT (in, see high_level[6B], audio_io[3B]), AUDIO_IN_1_RAW_RIGHT (in, see high_level[6B], audio_io[3B]), AUDIO_IN_2_FILTERED_LEFT (out, see high_level[6B], Codec[4D]), AUDIO_IN_2_FILTERED_RIGHT (out, see high_level[6B], Codec[5D]), AUDIO_IN_2_RAW_LEFT (in, see high_level[6C], audio_io[3B]), AUDIO_IN_2_RAW_RIGHT (in, see high_level[6B], audio_io[5B]), CODEC_OUT_LEFT (in, see high_level[6B], Codec[6B]), CODEC_OUT_RIGHT (in, see high_level[6B], Codec[6A]), FILTERED_OUT_LEFT (out, see high_level[6C], audio_io[5B]), FILTERED_OUT_RIGHT (out, see high_level[6C], audio_io[5B])

### Nets
+5VA: C35.1 C40.1 C46.1 C50.1 C58.1 C63.1 IC4.5(V+) IC5.5(V+) IC6.5(V+) IC7.5(V+) IC8.5(V+) IC9.5(V+) R24.2
+VREF: C45.2 R16.2 R20.2 R24.1 R25.2 R26.2 R30.2 R38.2 R42.2
GND: C35.2 C38.2 C39.2 C40.2 C43.2 C44.2 C45.1 C46.2 C49.2 C50.2 C53.2 C58.2 C61.2 C62.2 C63.2 C66.2 C67.2 IC4.2(V-) IC5.2(V-) IC6.2(V-) IC7.2(V-) IC8.2(V-) IC9.2(V-) R19.1 R23.1 R25.1 R29.1 R33.1 R41.1 R45.1 RV1.1 RV2.1 RV3.1 RV4.1 RV5.1 RV6.1
AUDIO_IN_1_FILTERED_LEFT: C37.2 ; port AUDIO_IN_1_FILTERED_LEFT
AUDIO_IN_1_FILTERED_RIGHT: C42.2 ; port AUDIO_IN_1_FILTERED_RIGHT
AUDIO_IN_1_RAW_LEFT: R17.1 RV3.2 ; port AUDIO_IN_1_RAW_LEFT
AUDIO_IN_1_RAW_RIGHT: R21.1 RV4.2 ; port AUDIO_IN_1_RAW_RIGHT
AUDIO_IN_2_FILTERED_LEFT: C60.2 ; port AUDIO_IN_2_FILTERED_LEFT
AUDIO_IN_2_FILTERED_RIGHT: C65.2 ; port AUDIO_IN_2_FILTERED_RIGHT
AUDIO_IN_2_RAW_LEFT: R39.1 RV1.2 ; port AUDIO_IN_2_RAW_LEFT
AUDIO_IN_2_RAW_RIGHT: R43.1 RV2.2 ; port AUDIO_IN_2_RAW_RIGHT
BUFF_IN_LEFT: C36.2 C59.2 IC4.3(IN+) IC6.3(IN+) R16.1 R38.1
BUFF_IN_RIGHT: C41.2 C64.2 IC5.3(IN+) IC7.3(IN+) R20.1 R42.1
CODEC_OUT_LEFT: C47.1 ; port CODEC_OUT_LEFT
CODEC_OUT_RIGHT: C51.1 ; port CODEC_OUT_RIGHT
FILTERED_OUT_LEFT: C48.2 R29.2 RV5.2 ; port FILTERED_OUT_LEFT
FILTERED_OUT_RIGHT: C52.2 R33.2 RV6.2 ; port FILTERED_OUT_RIGHT
IN_RF_LEFT: C36.1 C37.1 C38.1 C39.1 C59.1 C60.1 C61.1 C62.1 R17.2 R18.2 R19.2 R39.2 R40.2 R41.2
IN_RF_RIGHT: C41.1 C42.1 C43.1 C44.1 C64.1 C65.1 C66.1 C67.1 R21.2 R22.2 R23.2 R43.2 R44.2 R45.2
OUT_BIAS_L: C47.2 R26.1 R27.1
OUT_BIAS_R: C51.2 R30.1 R31.1
OUT_FILT_L: C49.1 IC8.3(IN+) R27.2
OUT_FILT_R: C53.1 IC9.3(IN+) R31.2
OUT_RC_L: C48.1 R28.2
OUT_RC_R: C52.1 R32.2
NetIC4_1: IC4.1(OUT) IC4.4(IN-) R18.1
NetIC5_1: IC5.1(OUT) IC5.4(IN-) R22.1
NetIC6_1: IC6.1(OUT) IC6.4(IN-) R40.1
NetIC7_1: IC7.1(OUT) IC7.4(IN-) R44.1
NetIC8_1: IC8.1(OUT) IC8.4(IN-) R28.1
NetIC9_1: IC9.1(OUT) IC9.4(IN-) R32.1

### Library data of the parts
C35 C40 C46 C50 C58 C63 = CMP-06035-001619-1: as C24 on sheet Codec; Dielectric: X7S; Tolerance: 20%; Length: 600um; Width: 300um; Voltage Rating (DC): 16V; Thickness: 300um
C36 C41 C47 C51 C59 C64 = CMP-06035-055122-1: as C56 on sheet Codec
C37 C42 C48 C52 C60 C65 = CMP-06035-021772-1: Ceramic Capacitor for Automotive 10uF ±20% 4VDC X7T 0603 Paper T/R
C38 C39 C43 C44 C61 C62 C66 C67 = CMP-06035-007229-1: Ceramic Capacitor for Automotive 220pF ±10% 50VDC X7R 0402 Paper T/R; Voltage Rating (DC): 50V; Case Code (Metric): 1005; Max Operating Temperature: 125°C; Case Code (Imperial): 0402; Length: 1mm; Termination: SMD/SMT; Package Quantity: 50000; Min Operating Temperature: -55°C; Radiation Hardening: No; Dielectric: X7R; Packaging: Tape and Reel; Mount: Surface Mount; Case/Package: 0402; Height: 0.5mm; Tolerance: 10%; Depth: 0.5mm; Voltage Rating: 50V
C45 = CMP-06035-055308-1: Ceramic Capacitor for Automotive 47uF ±10% 10VDC X7S 1210 Embossed T/R
C49 C53 = CMP-06035-038116-1: Ceramic Capacitor for Automotive 1nF ±10% 50VDC X7R 0402 Paper T/R
IC4-IC9 = TLV9161IDBVR: as IC12 on sheet Expression_Pedal; Datasheet Link: https://www.ti.com/lit/ds/symlink/tlv9161.pdf?HQS=dis-mous-null-mousermode-dsf-pf-null-wwe&ts=1675947383550&ref_url=https%253A%252F%252Fwww.mouser.de%252F; Height: 1.45mm; Manufacturer_Part_Number: TLV9161IDBVR; Mouser Part Number: 595-TLV9161IDBVR; Mouser Price/Stock: https://www.mouser.co.uk/ProductDetail/Texas-Instruments/TLV9161IDBVR?qs=Rp5uXu7WBW%2FkWJAGvxG3xQ%3D%3D; Arrow Part Number: TLV9161IDBVR; Arrow Price/Stock: https://www.arrow.com/en/products/tlv9161idbvr/texas-instruments?utm_currency=USD&region=nac
R16 R19 R20 R23 R26 R30 R38 R41 R42 R45 = CMP-2002-07947-3: RES SMD 1M OHM 5% 1/16W 0402; Temperature Coefficient: 100ppm/°C; Max Power Dissipation: 63mW; Voltage Rating: 50V; Power Rating: 62.5mW; Tolerance: 5%; Resistance Tolerance: 5%; RoHS Compliant: Yes; Width: 0.02inch; Resistor Type: Thick Film; Case/Package: 0402; Depth: 0.5mm; Case Code (Imperial): 0402; Max Operating Temperature: 155°C; Packaging: Tape and Reel; Length: 1mm; Military Standard: Not; REACH SVHC: No SVHC; Min Operating Temperature: -55°C; Construction: Rectangular; Termination: SMD/SMT; Lead Free: Lead Free; Features: Moisture Resistant; Case Code (Metric): 1005; Package Quantity: 1; Height: 0.016inch; Size Code: 0402; Weight: 2.3E-05oz; Series: RC; Number of Terminations: 2
R17 R21 R28 R32 R39 R43 = CMP-2002-07914-1: Manufacturer: Yageo / Phycomp; Part Number: RC0402JR-07100RL
R18 R22 R24 R25 R27 R31 R40 R44 = CMP-2002-01782-2: RES 1kΩ ±5% 0.063W 0402; Temperature Coefficient: 100ppm/°C; Voltage Rating: 50V; Power Rating: 62.5mW; Max Power Dissipation: 63mW; Termination: SMD/SMT; Series: AC; Features: Moisture Resistant; Lead Free: Lead Free; Height: 0.015inch; Tolerance: 5%; Case/Package: 0402; Case Code (Imperial): 0402; Length: 0.039inch; Resistor Type: Thick Film; Width: 0.5mm; Case Code (Metric): 1005; Number of Terminations: 2; Max Operating Temperature: 155°C; Weight: 2.3E-05oz; Min Operating Temperature: -55°C; RoHS Compliant: Yes; Packaging: Tape and Reel
R29 R33 = CMP-2002-07854-2: as R36 on sheet Codec; REACH SVHC: No SVHC; Case/Package: 0402; Termination: SMD/SMT; Max Operating Temperature: 155°C; Contact Plating: Tin; Resistance Tolerance: 1%; Radiation Hardening: No; Voltage Rating: 50V; Lead Free: Lead Free; Length: 1mm; Depth: 0.5mm; Number of Pins: 2; RoHS Compliant: Yes; Case Code (Imperial): 0402; Case Code (Metric): 1005; Min Operating Temperature: -55°C; Packaging: Tape and Reel; Technology: THICK FILM; Series: RC; Number of Terminations: 2; Resistor Type: Thick Film; Tolerance: 1%; Working Voltage: 50V; Military Standard: Not; Construction: Rectangular
RV1-RV6 = CG0402MLU-12G: Varistor; Manufacturer_Name: Bourns; Datasheet Link: https://bourns.com/docs/product-datasheets/mlu.pdf?sfvrsn=1940d498_27; Height: 0.41mm; Manufacturer_Part_Number: CG0402MLU-12G; Mouser Part Number: 652-CG0402MLU-12G; Mouser Price/Stock: https://www.mouser.co.uk/ProductDetail/Bourns/CG0402MLU-12G?qs=m8myXnDJXpUNz33UIHxVhA%3D%3D; Arrow Part Number: CG0402MLU-12G; Arrow Price/Stock: https://www.arrow.com/en/products/cg0402mlu-12g/bourns?utm_currency=USD&region=nac

## Sheet Memory.SchDoc
size A3; SheetNumber: 6; SheetTotal: 13
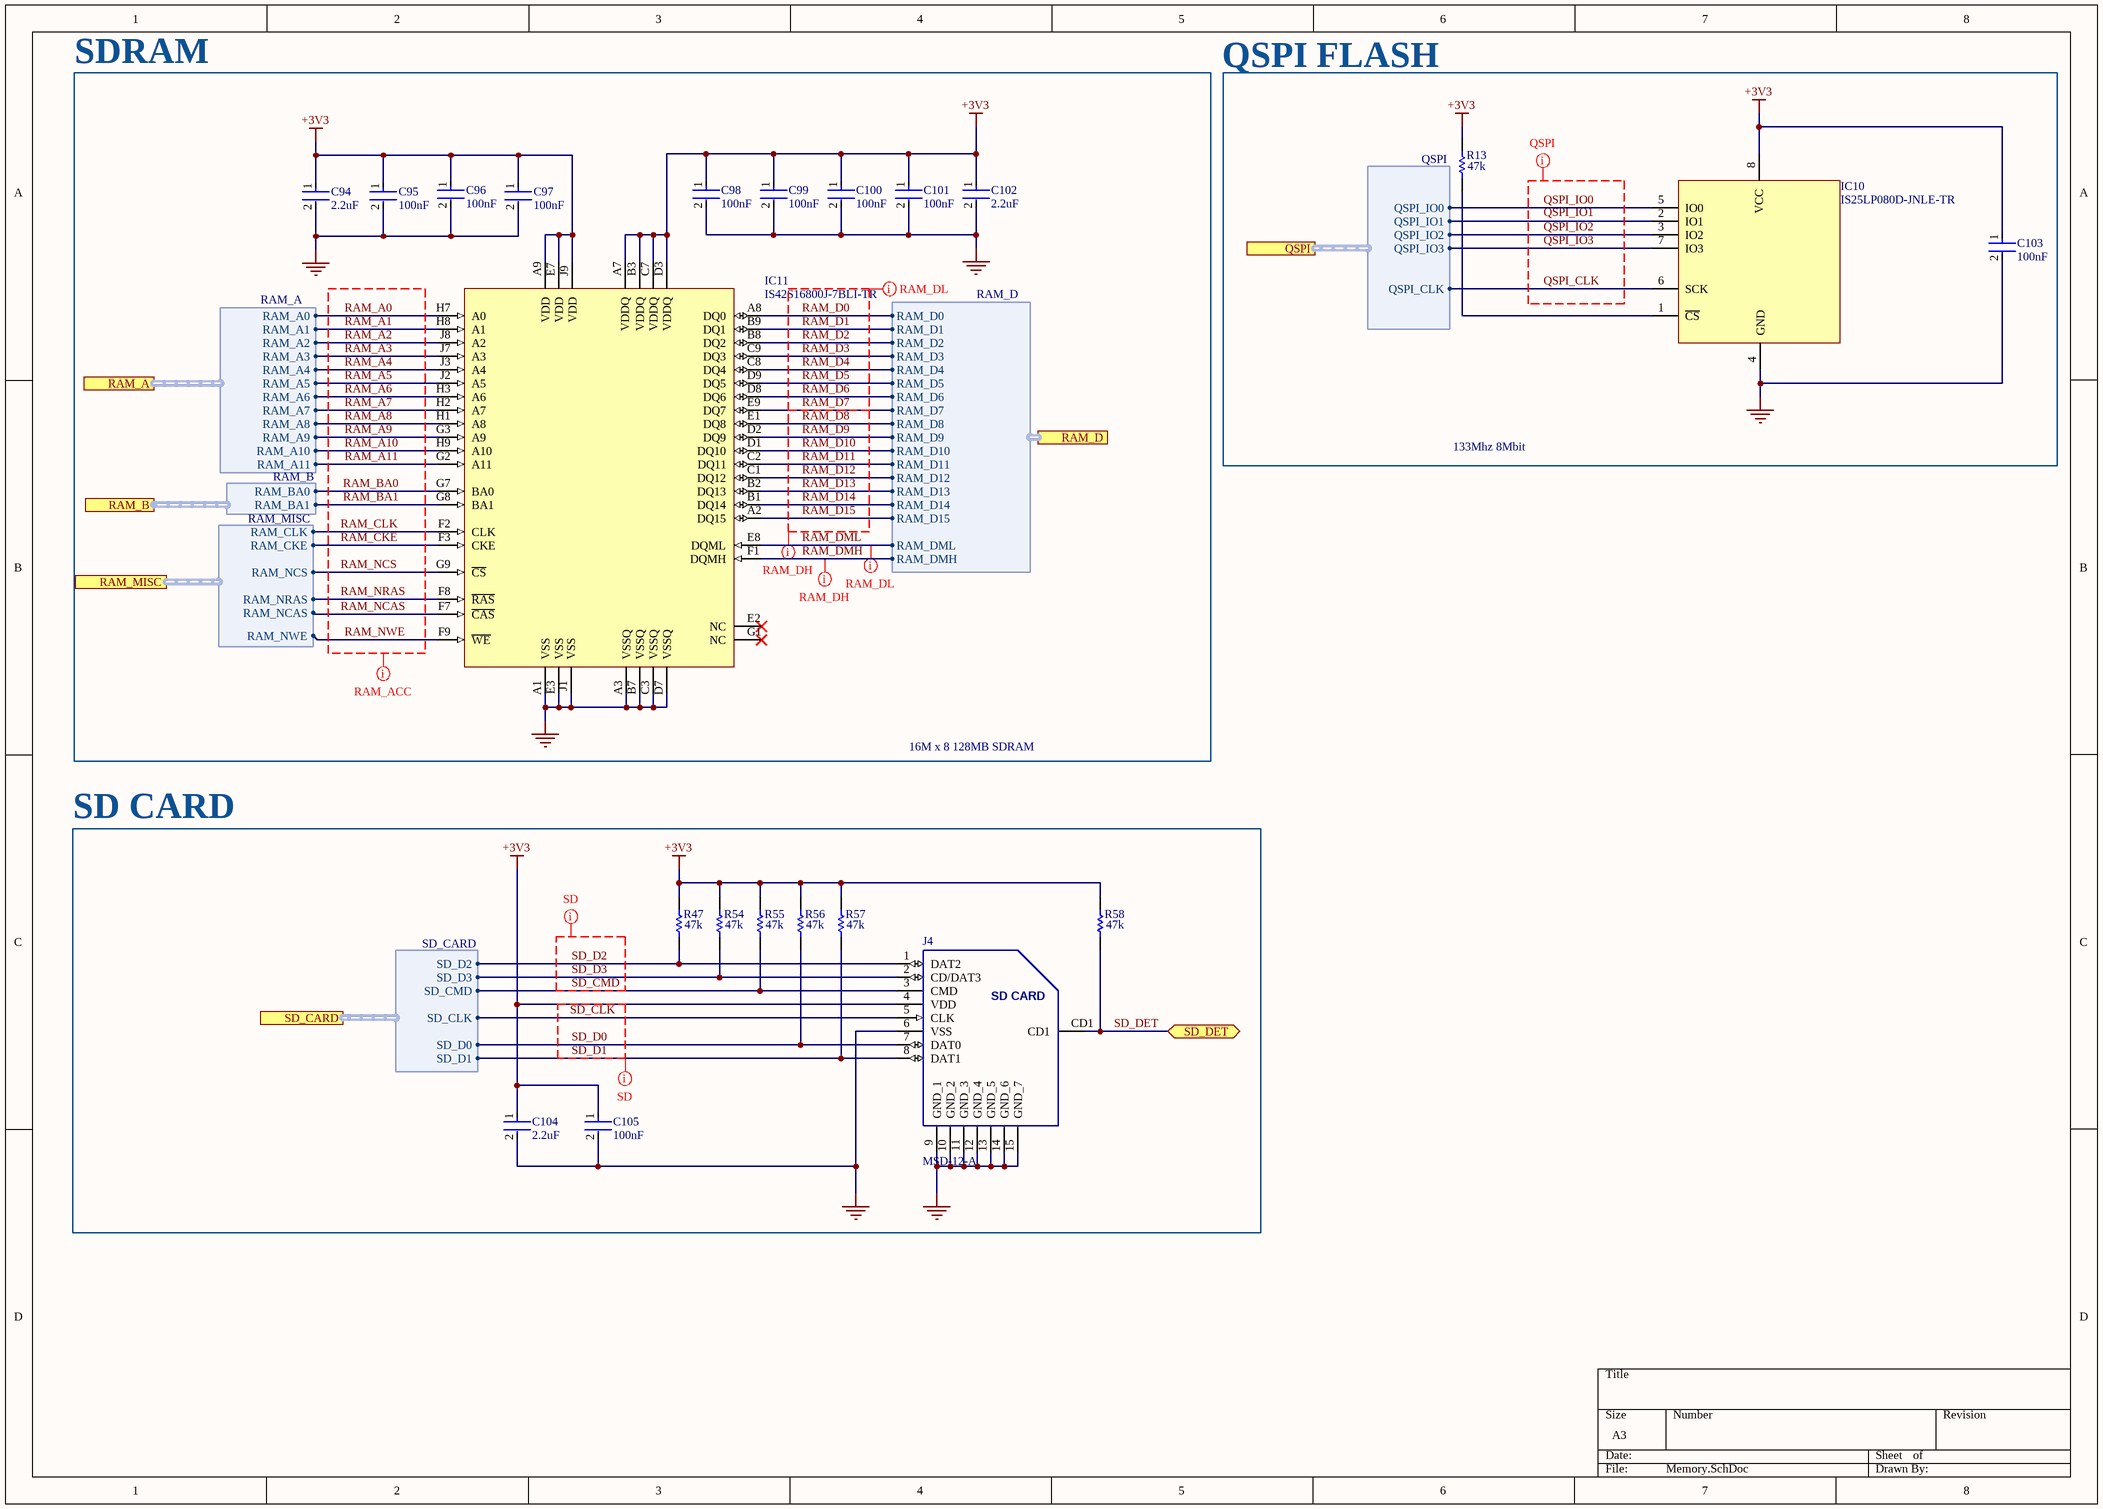
[diagram p4: Memory.SchDoc]

### Parts
C94  Capacitance: 2.2uF  [FP-GCH188-0_1-e0_2_0_5-MFG]  (hidden comment: GCM188C71A225KE02D)
C95  Capacitance: 100nF  [FP-GCM155-0_05-IPC_A]  (hidden comment: GCM155R71H104ME02J)
C96  Capacitance: 100nF  [FP-GCM155-0_05-IPC_A]  (hidden comment: GCM155R71H104ME02J)
C97  Capacitance: 100nF  [FP-GCM155-0_05-IPC_A]  (hidden comment: GCM155R71H104ME02J)
C98  Capacitance: 100nF  [FP-GCM155-0_05-IPC_A]  (hidden comment: GCM155R71H104ME02J)
C99  Capacitance: 100nF  [FP-GCM155-0_05-IPC_A]  (hidden comment: GCM155R71H104ME02J)
C100  Capacitance: 100nF  [FP-GCM155-0_05-IPC_A]  (hidden comment: GCM155R71H104ME02J)
C101  Capacitance: 100nF  [FP-GCM155-0_05-IPC_A]  (hidden comment: GCM155R71H104ME02J)
C102  Capacitance: 2.2uF  [FP-GCH188-0_1-e0_2_0_5-MFG]  (hidden comment: GCM188C71A225KE02D)
C103  Capacitance: 100nF  [FP-GCM155-0_05-IPC_A]  (hidden comment: GCM155R71H104ME02J)
C104  Capacitance: 2.2uF  [FP-GCH188-0_1-e0_2_0_5-MFG]  (hidden comment: GCM188C71A225KE02D)
C105  Capacitance: 100nF  [FP-GCM155-0_05-IPC_A]  (hidden comment: GCM155R71H104ME02J)
IC10  IS25LP080D-JNLE-TR  [SOIC127P600X175-8N]
IC11  IS42S16800J-7BLI-TR  [IS42S16800J-7BLI-TR]
J4  MSD-12-A  [MSD12A]
R13  Resistance: 47k  [RESC1005X40X25LL05T10]  (hidden comment: RC0402JR-0747KL)
R47  Resistance: 47k  [RESC1005X40X25LL05T10]  (hidden comment: RC0402JR-0747KL)
R54  Resistance: 47k  [RESC1005X40X25LL05T10]  (hidden comment: RC0402JR-0747KL)
R55  Resistance: 47k  [RESC1005X40X25LL05T10]  (hidden comment: RC0402JR-0747KL)
R56  Resistance: 47k  [RESC1005X40X25LL05T10]  (hidden comment: RC0402JR-0747KL)
R57  Resistance: 47k  [RESC1005X40X25LL05T10]  (hidden comment: RC0402JR-0747KL)
R58  Resistance: 47k  [RESC1005X40X25LL05T10]  (hidden comment: RC0402JR-0747KL)

### Blocks framed on the sheet
SDRAM: C94-C102 IC11
QSPI FLASH: C103 IC10 R13
SD CARD: C104 C105 J4 R47 R54-R58

### Ports
QSPI (harness QSPI, see high_level[3A], MCU_Connections[4B]), RAM_A (harness RAM_A, see high_level[3A], MCU_Connections[2B]), RAM_B (harness RAM_B, see high_level[3A], MCU_Connections[2C]), RAM_D (harness RAM_D, see high_level[3A], MCU_Connections[2D]), RAM_MISC (harness RAM_MISC, see high_level[3A], MCU_Connections[2C]), SD_CARD (harness SD_CARD, see high_level[3A], MCU_Connections[4C]), SD_DET (bidir, see high_level[3A], MCU_Connections[5C])

### Harnesses
RAM_D: RAM_D0, RAM_D1, RAM_D2, RAM_D3, RAM_D4, RAM_D5, RAM_D6, RAM_D7, RAM_D8, RAM_D9, RAM_D10, RAM_D11, RAM_D12, RAM_D13, RAM_D14, RAM_D15, RAM_DML, RAM_DMH
RAM_A: RAM_A0, RAM_A1, RAM_A2, RAM_A3, RAM_A4, RAM_A5, RAM_A6, RAM_A7, RAM_A8, RAM_A9, RAM_A10, RAM_A11
RAM_B: RAM_BA0, RAM_BA1
RAM_MISC: RAM_CLK, RAM_CKE, RAM_NCS, RAM_NRAS, RAM_NCAS, RAM_NWE
SD_CARD: SD_D2, SD_D3, SD_CMD, SD_CLK, SD_D0, SD_D1
QSPI: QSPI_IO0, QSPI_IO1, QSPI_IO2, QSPI_IO3, QSPI_CLK

### Nets
+3V3: C94.1 C95.1 C96.1 C97.1 C98.1 C99.1 C100.1 C101.1 C102.1 C103.1 C104.1 C105.1 IC10.8(VCC) IC11.A7(VDDQ) IC11.A9(VDD) IC11.B3(VDDQ) IC11.C7(VDDQ) IC11.D3(VDDQ) IC11.E7(VDD) IC11.J9(VDD) J4.4(VDD) R13.2 R47.2 R54.2 R55.2 R56.2 R57.2 R58.2
GND: C94.2 C95.2 C96.2 C97.2 C98.2 C99.2 C100.2 C101.2 C102.2 C103.2 C104.2 C105.2 IC10.4(GND) IC11.A1(VSS) IC11.A3(VSSQ) IC11.B7(VSSQ) IC11.C3(VSSQ) IC11.D7(VSSQ) IC11.E3(VSS) IC11.J1(VSS) J4.6(VSS) J4.9(GND_1) J4.10(GND_2) J4.11(GND_3) J4.12(GND_4) J4.13(GND_5) J4.14(GND_6) J4.15(GND_7)
QSPI_CLK: IC10.6(SCK) ; port QSPI.QSPI_CLK
QSPI_IO0: IC10.5(IO0) ; port QSPI.QSPI_IO0
QSPI_IO2: IC10.3(IO2) ; port QSPI.QSPI_IO2
QSPI_IO3: IC10.7(IO3) ; port QSPI.QSPI_IO3
RAM_A0: IC11.H7(A0) ; port RAM_A.RAM_A0
RAM_A1: IC11.H8(A1) ; port RAM_A.RAM_A1
RAM_A2: IC11.J8(A2) ; port RAM_A.RAM_A2
RAM_A3: IC11.J7(A3) ; port RAM_A.RAM_A3
RAM_A4: IC11.J3(A4) ; port RAM_A.RAM_A4
RAM_A5: IC11.J2(A5) ; port RAM_A.RAM_A5
RAM_A6: IC11.H3(A6) ; port RAM_A.RAM_A6
RAM_A7: IC11.H2(A7) ; port RAM_A.RAM_A7
RAM_A8: IC11.H1(A8) ; port RAM_A.RAM_A8
RAM_A9: IC11.G3(A9) ; port RAM_A.RAM_A9
RAM_A10: IC11.H9(A10) ; port RAM_A.RAM_A10
RAM_A11: IC11.G2(A11) ; port RAM_A.RAM_A11
RAM_BA0: IC11.G7(BA0) ; port RAM_B.RAM_BA0
RAM_BA1: IC11.G8(BA1) ; port RAM_B.RAM_BA1
RAM_CKE: IC11.F3(CKE) ; port RAM_MISC.RAM_CKE
RAM_CLK: IC11.F2(CLK) ; port RAM_MISC.RAM_CLK  [project net FMC_SDCLK]
RAM_D0: IC11.A8(DQ0) ; port RAM_D.RAM_D0
RAM_D1: IC11.B9(DQ1) ; port RAM_D.RAM_D1
RAM_D2: IC11.B8(DQ2) ; port RAM_D.RAM_D2
RAM_D3: IC11.C9(DQ3) ; port RAM_D.RAM_D3
RAM_D4: IC11.C8(DQ4) ; port RAM_D.RAM_D4
RAM_D5: IC11.D9(DQ5) ; port RAM_D.RAM_D5
RAM_D6: IC11.D8(DQ6) ; port RAM_D.RAM_D6
RAM_D7: IC11.E9(DQ7) ; port RAM_D.RAM_D7
RAM_D8: IC11.E1(DQ8) ; port RAM_D.RAM_D8
RAM_D9: IC11.D2(DQ9) ; port RAM_D.RAM_D9
RAM_D10: IC11.D1(DQ10) ; port RAM_D.RAM_D10
RAM_D11: IC11.C2(DQ11) ; port RAM_D.RAM_D11
RAM_D12: IC11.C1(DQ12) ; port RAM_D.RAM_D12
RAM_D13: IC11.B2(DQ13) ; port RAM_D.RAM_D13
RAM_D14: IC11.B1(DQ14) ; port RAM_D.RAM_D14
RAM_D15: IC11.A2(DQ15) ; port RAM_D.RAM_D15
RAM_DMH: IC11.F1(DQMH) ; port RAM_D.RAM_DMH
RAM_DML: IC11.E8(DQML) ; port RAM_D.RAM_DML
RAM_NCAS: IC11.F7(~{CAS}) ; port RAM_MISC.RAM_NCAS
RAM_NCS: IC11.G9(~{CS}) ; port RAM_MISC.RAM_NCS
RAM_NRAS: IC11.F8(~{RAS}) ; port RAM_MISC.RAM_NRAS
RAM_NWE: IC11.F9(~{WE}) ; port RAM_MISC.RAM_NWE
SD_CLK: J4.5(CLK) ; port SD_CARD.SD_CLK
SD_CMD: J4.3(CMD) R55.1 ; port SD_CARD.SD_CMD
SD_D0: J4.7(DAT0) R56.1 ; port SD_CARD.SD_D0
SD_D1: J4.8(DAT1) R57.1 ; port SD_CARD.SD_D1
SD_D2: J4.1(DAT2) R47.1 ; port SD_CARD.SD_D2
SD_D3: J4.2(CD/DAT3) R54.1 ; port SD_CARD.SD_D3
SD_DET: J4.CD1 R58.1 ; port SD_DET
NetIC10_1: IC10.1(~{CS}) R13.1
NetIC10_2: IC10.2(IO1) ; port QSPI.QSPI_IO1

Not connected (* = marked no-connect by the designer): IC11 E2(NC)* G1(NC)*

### Layout directives
mark named RAM_ACC: RAM_A0, RAM_A1, RAM_A2, RAM_A3, RAM_A4, RAM_A5, RAM_A6, RAM_A7, RAM_A8, RAM_A9, RAM_A10, RAM_A11, RAM_BA0, RAM_BA1, RAM_CKE, RAM_CLK, RAM_NCAS, RAM_NCS, RAM_NRAS, RAM_NWE
mark named RAM_DL: RAM_D0, RAM_D1, RAM_D2, RAM_D3, RAM_D4, RAM_D5, RAM_D6, RAM_D7, RAM_DML
mark named RAM_DH: RAM_D7, RAM_D8, RAM_D9, RAM_D10, RAM_D11, RAM_D12, RAM_D13, RAM_D14, RAM_D15, RAM_DMH
mark named QSPI: QSPI_CLK, QSPI_IO0, QSPI_IO1, QSPI_IO2, QSPI_IO3
mark named SD: SD_CMD, SD_D1, SD_D2, SD_D3

### Notes on the sheet
- 133Mhz 8Mbit
- 16M x 8 128MB SDRAM
- Labels drawn without touching a wire or pin: QSPI_IO1
- (in symbol MSD-12-A) SD CARD

### Library data of the parts
C94 C102 C104 = CMP-00260-57357036-1: GCM188C71A225KE02D Multilayer Ceramic Capacitor, 2.2 uF, 10 V, ± 10%, X7S, 0603 [1608 Metric]; NexarPartId: 57357036; RoHS: Non-Compliant; Lifecycle Status: Production
C95-C101 C103 C105 = CMP-06035-028957-1: Ceramic Capacitor for Automotive 100nF ±20% 50VDC X7R 0402 Paper T/R
IC10 = IS25LP080D-JNLE-TR: Integrated Circuit; Manufacturer_Name: Integrated Silicon Solution Inc.; Datasheet Link: https://www.mouser.com/datasheet/2/198/25LP-WP080D-1003192.pdf; Height: 1.75mm; Manufacturer_Part_Number: IS25LP080D-JNLE-TR; Mouser Part Number: 870-IS25LP080DJNLETR; Mouser Price/Stock: https://www.mouser.co.uk/ProductDetail/ISSI/IS25LP080D-JNLE-TR?qs=pif5%252B9MYt0VkH9msMJ5aTQ%3D%3D; Arrow Part Number: IS25LP080D-JNLE-TR; Arrow Price/Stock: https://www.arrow.com/en/products/is25lp080d-jnle-tr/integrated-silicon-solution-inc?region=nac
IC11 = IS42S16800J-7BLI-TR: Integrated Circuit; Manufacturer_Name: Integrated Silicon Solution Inc.; Datasheet Link: https://www.mouser.be/datasheet/2/198/42_45S81600J_16800J-3460583.pdf; Height: 1.2mm; Manufacturer_Part_Number: IS42S16800J-7BLI-TR
J4 = MSD-12-A: Connector; Manufacturer_Name: Same Sky; Datasheet Link: https://www.sameskydevices.com/product/resource/MSD-12-A.pdf; Height: 1.6mm; Manufacturer_Part_Number: MSD-12-A; Mouser Part Number: 179-MSD-12-A; Mouser Price/Stock: https://www.mouser.co.uk/ProductDetail/Same-Sky/MSD-12-A?qs=Z%252BL2brAPG1KTGgvYejyeAQ%3D%3D; Arrow Part Number: MSD-12-A; Arrow Price/Stock: https://www.arrow.com/en/products/msd-12-a/cui-devices?utm_currency=USD&region=nac
R13 R47 R54-R58 = CMP-1011-00114-2: Manufacturer: Yageo / Phycomp; Part Number: RC0402JR-0747KL

## Sheet Power.SchDoc
size A3; SheetNumber: 4; SheetTotal: 13
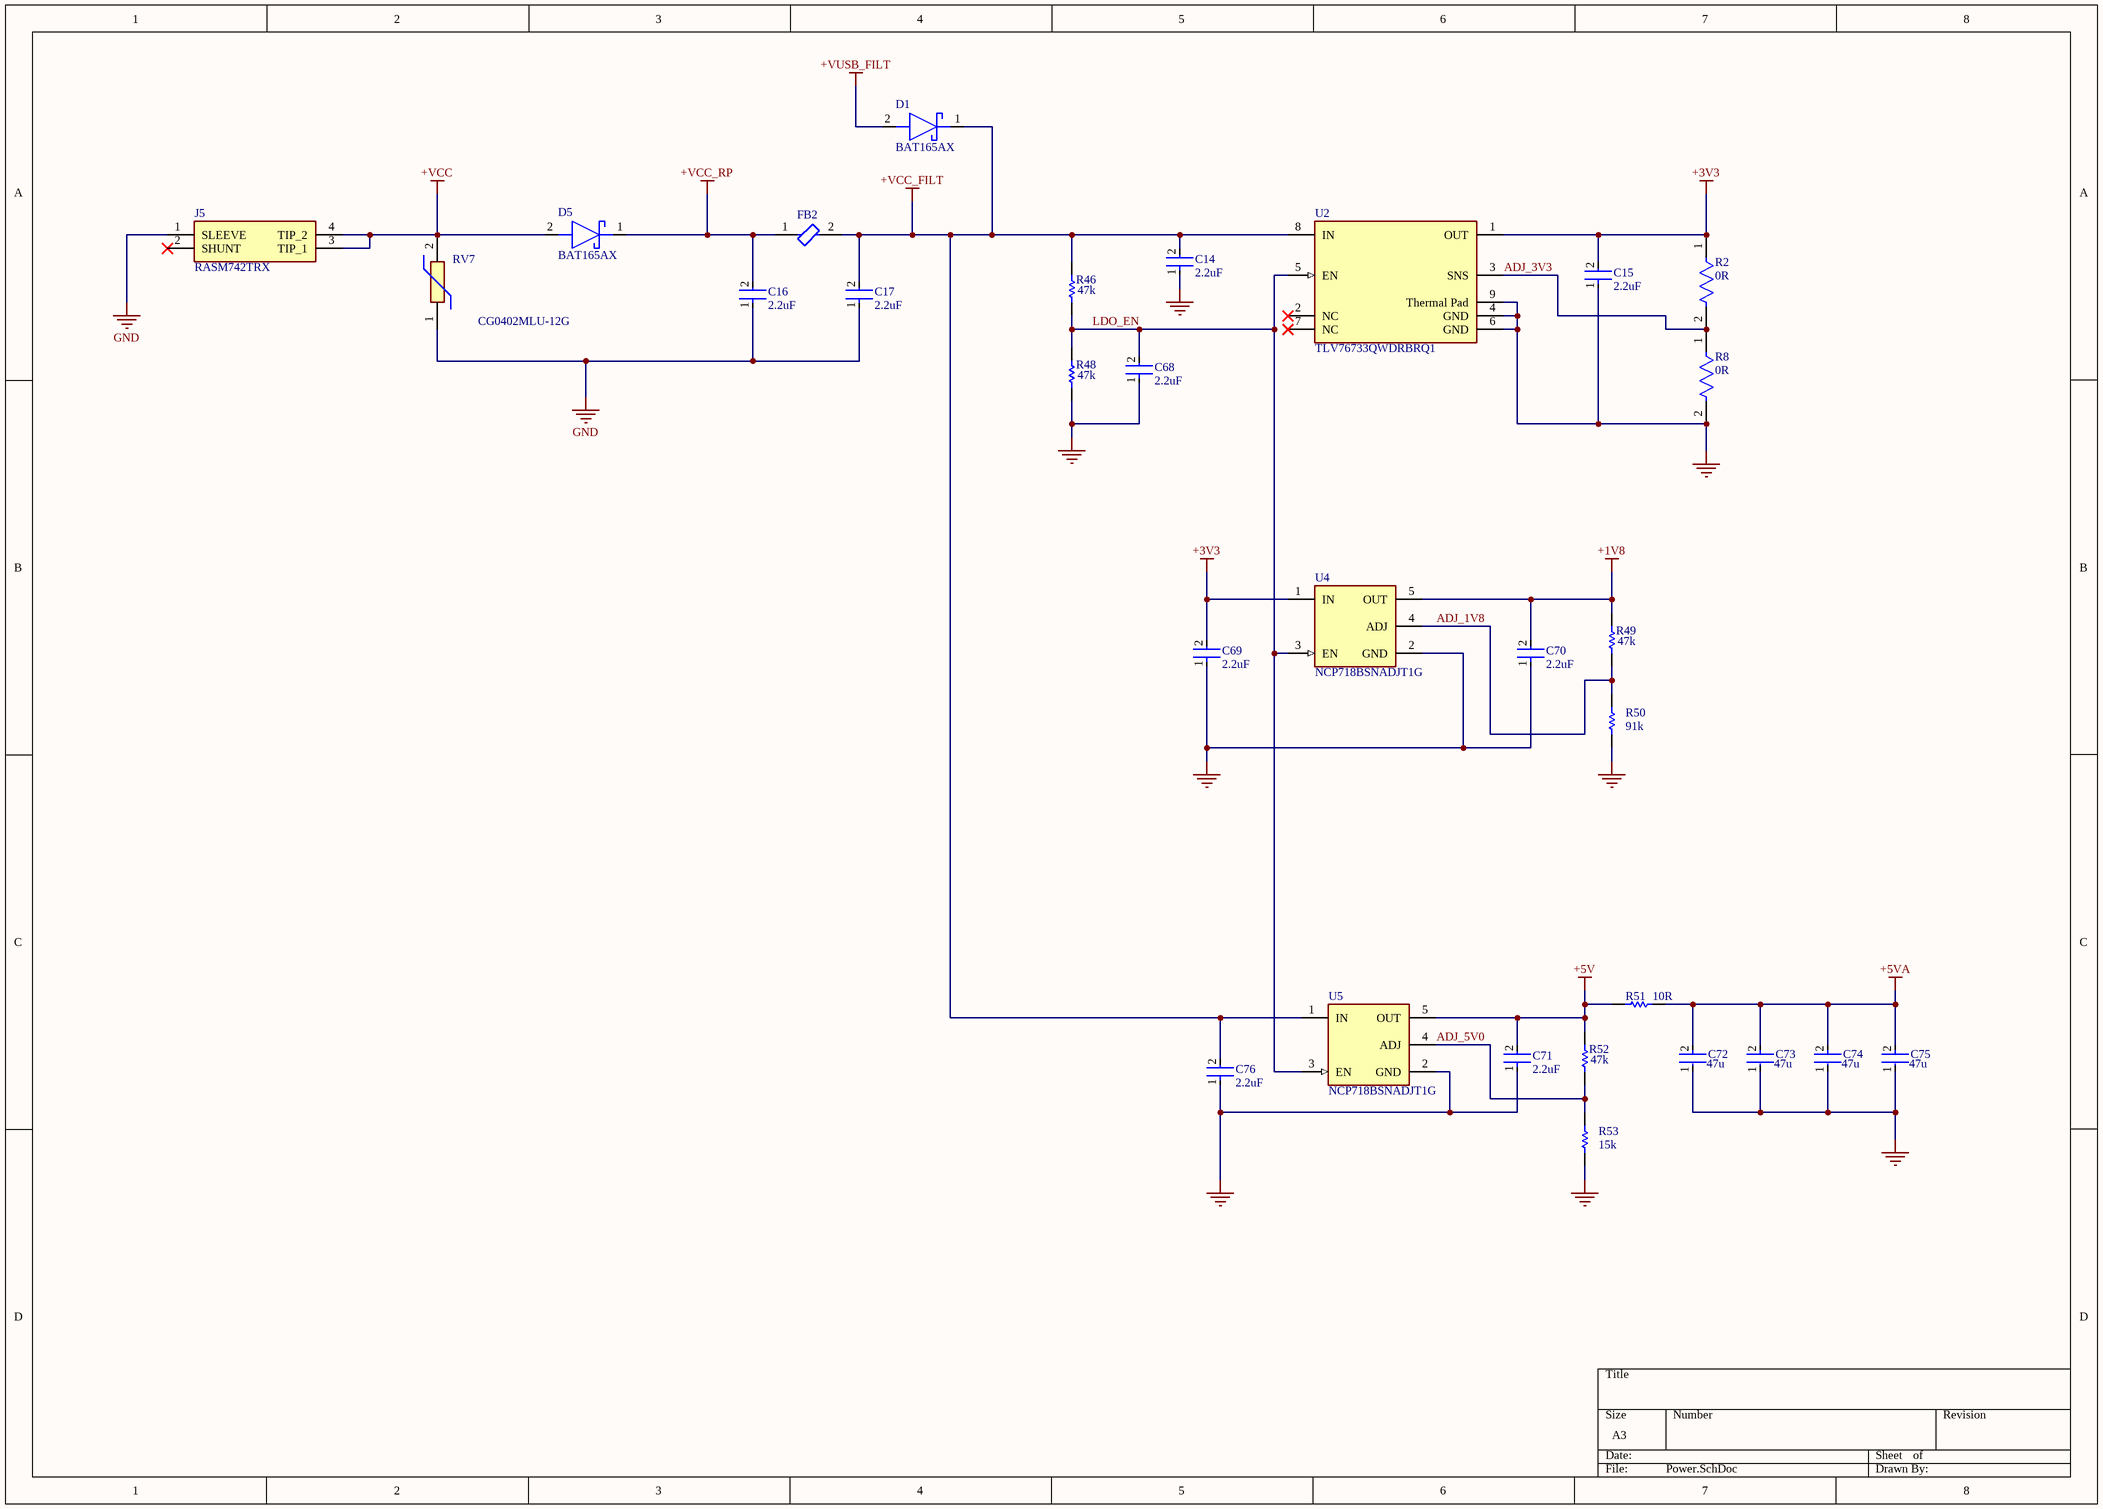
[diagram p5: Power.SchDoc]

### Parts
C14  Capacitance: 2.2uF  [FP-GCH188-0_1-e0_2_0_5-MFG]  (hidden comment: GCM188C71A225KE02D)
C15  Capacitance: 2.2uF  [FP-GCH188-0_1-e0_2_0_5-MFG]  (hidden comment: GCM188C71A225KE02D)
C16  Capacitance: 2.2uF  [FP-GCH188-0_1-e0_2_0_5-MFG]  (hidden comment: GCM188C71A225KE02D)
C17  Capacitance: 2.2uF  [FP-GCH188-0_1-e0_2_0_5-MFG]  (hidden comment: GCM188C71A225KE02D)
C68  Capacitance: 2.2uF  [FP-GCH188-0_1-e0_2_0_5-MFG]  (hidden comment: GCM188C71A225KE02D)
C69  Capacitance: 2.2uF  [FP-GCH188-0_1-e0_2_0_5-MFG]  (hidden comment: GCM188C71A225KE02D)
C70  Capacitance: 2.2uF  [FP-GCH188-0_1-e0_2_0_5-MFG]  (hidden comment: GCM188C71A225KE02D)
C71  Capacitance: 2.2uF  [FP-GCH188-0_1-e0_2_0_5-MFG]  (hidden comment: GCM188C71A225KE02D)
C72  Capacitance: 47u  [FP-GCM32E-0_3-MFG]  (hidden comment: GCM32EC71A476KE02K)
C73  Capacitance: 47u  [FP-GCM32E-0_3-MFG]  (hidden comment: GCM32EC71A476KE02K)
C74  Capacitance: 47u  [FP-GCM32E-0_3-MFG]  (hidden comment: GCM32EC71A476KE02K)
C75  Capacitance: 47u  [FP-GCM32E-0_3-MFG]  (hidden comment: GCM32EC71A476KE02K)
C76  Capacitance: 2.2uF  [FP-GCH188-0_1-e0_2_0_5-MFG]  (hidden comment: GCM188C71A225KE02D)
D1  BAT165AX  [BAT165AX]
D5  BAT165AX  [BAT165AX]
FB2  MPZ1005S121ET000  [FP-MPZ1005-MFG]  (value not drawn)
J5  RASM742TRX  [RASM742TRX]
R2  Resistance: 0R  [FP-RMCF0402-MFG]  (hidden comment: RMCF0402ZT0R00)
R8  Resistance: 0R  [FP-RMCF0402-MFG]  (hidden comment: RMCF0402ZT0R00)
R46  Resistance: 47k  [RESC1005X40X25LL05T10]  (hidden comment: RC0402JR-0747KL)
R48  Resistance: 47k  [RESC1005X40X25LL05T10]  (hidden comment: RC0402JR-0747KL)
R49  Resistance: 47k  [RESC1005X40X25LL05T10]  (hidden comment: RC0402JR-0747KL)
R50  Resistance: 91k  [RESC1005X40X25LL05T10]  (hidden comment: RC0402JR-0791KL)
R51  Resistance: 10R  [RESC1608X55X25LL10T15]  (hidden comment: RC0603JR-1310RL)
R52  Resistance: 47k  [RESC1005X40X25LL05T10]  (hidden comment: RC0402JR-0747KL)
R53  Resistance: 15k  [RESC1005X40X25NL05T10]  (hidden comment: RC0402JR-0715KL)
RV7  CG0402MLU-12G  [VARC1005X41N]
U2  TLV76733QWDRBRQ1  [FP-DRB0008J-IPC_C]
U4  NCP718BSNADJT1G  [FP-419AE-01-IPC_C]
U5  NCP718BSNADJT1G  [FP-419AE-01-IPC_C]

### Nets
+1V8: C70.2 R49.2 U4.5(OUT)
+3V3: C15.2 C69.2 R2.1 U2.1(OUT) U4.1(IN)
+5V: C71.2 R51.1 R52.2 U5.5(OUT)
+5VA: C72.2 C73.2 C74.2 C75.2 R51.2
+VCC: D5.2(A) J5.3(TIP_1) J5.4(TIP_2) RV7.2
+VCC_FILT: C14.2 C17.2 C76.2 D1.1(K) FB2.2 R46.2 U2.8(IN) U5.1(IN)
+VCC_RP: C16.2 D5.1(K) FB2.1
+VUSB_FILT: D1.2(A)
GND: C14.1 C15.1 C16.1 C17.1 C68.1 C69.1 C70.1 C71.1 C72.1 C73.1 C74.1 C75.1 C76.1 J5.1(SLEEVE) R8.2 R48.1 R50.1 R53.1 RV7.1 U2.4(GND) U2.6(GND) U2.9(Thermal_Pad) U4.2(GND) U5.2(GND)
ADJ_1V8: R49.1 R50.2 U4.4(ADJ)
ADJ_3V3: R2.2 R8.1 U2.3(SNS)
ADJ_5V0: R52.1 R53.2 U5.4(ADJ)
LDO_EN: C68.2 R46.1 R48.2 U2.5(EN) U4.3(EN) U5.3(EN)

Not connected (* = marked no-connect by the designer): J5 2(SHUNT)*; U2 2(NC)* 7(NC)*

### Library data of the parts
C14-C17 C68-C71 C76 = CMP-00260-57357036-1: as C94 on sheet Memory; NexarPartId: 57357036; RoHS: Non-Compliant; Lifecycle Status: Production
C72-C75 = CMP-06035-055308-1: as C45 on sheet Input_Output_Filtering
D1 D5 = BAT165AX: Schottky Diode; Manufacturer_Name: Nexperia; Datasheet Link: https://assets.nexperia.com/documents/data-sheet/BAT165A.pdf; Height: 1.1mm; Manufacturer_Part_Number: BAT165AX; Mouser Part Number: 771-BAT165AX; Mouser Price/Stock: https://www.mouser.co.uk/ProductDetail/Nexperia/BAT165AX?qs=1fQ7IOp4WriMQ9TlJoQ5jw%3D%3D; Arrow Part Number: BAT165AX; Arrow Price/Stock: https://www.arrow.com/en/products/bat165ax/nexperia?utm_currency=USD&region=nac
FB2 = CMP-08257-000274-1: Power line Ferrite Bead 120Ω @ 100MHz 1.5A DCR 0.095Ω SMD 0402; Tolerance: 25%; Number of Lines: 1; Impedance: 120R; DC Resistance (DCR): 95mR; RoHS Compliant: Yes; Test Frequency: 100MHz; Length: 0.039inch; Case Code (Metric): 1005; Case/Package: 0402; Max Operating Temperature: 125°C; Max Current Rating: 1.5A; Termination: SMD/SMT; Case Code (Imperial): 0402; Width: 0.02inch; Weight: 2.3E-05oz; Max DC Current: 1.5A; Height: 0.022inch; Package Quantity: 10000; Mount: Surface Mount; Min Operating Temperature: -55°C; Packaging: Tape and Reel
J5 = RASM742TRX: Connector; Manufacturer_Name: Switchcraft; Datasheet Link: https://www.mouser.ph/ProductDetail/Switchcraft/RASM742TRX?qs=mcPJWgAPNrdcPY6U4InXHg%3D%3D&srsltid=AfmBOooMj0kEPMqk1k0gwFmsjJjNoSaW62hNPqqtUxzbBym_46hZI4RS; Height: 5.334mm; Manufacturer_Part_Number: RASM742TRX; Mouser Part Number: 502-RASM742TRX; Mouser Price/Stock: https://www.mouser.co.uk/ProductDetail/Switchcraft/RASM742TRX?qs=mcPJWgAPNrdcPY6U4InXHg%3D%3D; Arrow Part Number: RASM742TRX; Arrow Price/Stock: https://www.arrow.com/en/products/rasm742trx/switchcraft?region=nac
R2 R8 = CMP-26527-007617-1: as R34 on sheet Codec; Series: RMCF; RoHS Compliant: Yes; Features: Automotive AEC-Q200; Width: 0.02inch; Depth: 0.5mm; Resistor Type: Thick Film; Number of Terminations: 2; Radiation Hardening: No; Length: 0.039inch; Contact Plating: Tin; Case/Package: 0402; Min Operating Temperature: -55°C; Case Code (Metric): 1005; Construction: Rectangular; Mount: Surface Mount; Max Operating Temperature: 155°C; Max Power Dissipation: 63mW; Height: 0.016inch; Lead Free: Lead Free; Packaging: Tape and Reel; Technology: THICK FILM; Case Code (Imperial): 0402; Military Standard: Not
R46 R48 R49 R52 = CMP-1011-00114-2: Manufacturer: Yageo / Phycomp; Part Number: RC0402JR-0747KL
R50 = CMP-2002-07162-1: Manufacturer: Yageo / Phycomp; Part Number: RC0402JR-0791KL
R51 = CMP-2000-04315-1: Manufacturer: Yageo; Part Number: RC0603JR-1310RL
R53 = CMP-2002-07928-1: Manufacturer: Yageo / Phycomp; Part Number: RC0402JR-0715KL
RV7 = CG0402MLU-12G: Varistor; Manufacturer_Name: Bourns; Datasheet Link: https://bourns.com/docs/product-datasheets/mlu.pdf?sfvrsn=1940d498_27; Height: 0.41mm; Manufacturer_Part_Number: CG0402MLU-12G; Mouser Part Number: 652-CG0402MLU-12G; Mouser Price/Stock: https://www.mouser.co.uk/ProductDetail/Bourns/CG0402MLU-12G?qs=m8myXnDJXpUNz33UIHxVhA%3D%3D; Arrow Part Number: CG0402MLU-12G; Arrow Price/Stock: https://www.arrow.com/en/products/cg0402mlu-12g/bourns?utm_currency=USD&region=nac
U2 = CMP-04917-000370-1: IC OPAMP; RoHS Compliant: Yes
U4 U5 = CMP-07128-000004-1: 300 MA LOW IQ WIDE INPUT; Manufacturer: On Semiconductor; Max Supply Voltage: 24V; Output Type: AdjustableProgrammable; Min Supply Voltage: 2.5V; Max Junction Temp: +125°C; Nominal Supply Current: 50-300uA; Dropout Voltage: 480mV; Accuracy Percentage: 2%; Standoff Height: 0.01mm; Output Voltage: 1.2-5V; Number Of Outputs: 1; Output Current: 300mA; Lead Free: Yes; Temperature: to +125°C; ComponentLink2URL: https://www.onsemi.com/pub/Collateral/NCP718-D.PDF; Height: 1mm; ComponentLink2Description: Datasheet; Octopart: https://octopart.com/ncp718bsnadjt1g-on+semiconductor-87658781; Manufacturer Part Number: NCP718BSNADJT1G; Device Class L1: Integrated Circuits (ICs); Device Class L2: Power Management ICs; Device Class L3: Voltage Regulators - Linear; Digikey Description: 300 MA LOW IQ WIDE INPUT; Temperature Range High: +125°C; Package: 419AE-01; Mouser Description: LDO Regulator, 300 mA, Wide Vin, Ultra-Low Iq Adjustable, Non-Active Discharge, TSOT23-5; Category: IC; Automotive: No; RoHS: TRUE